# EAGLE design MAAV_Vehicle_13v1 (EAGLE 6.4)

## Sheet 1 of 8
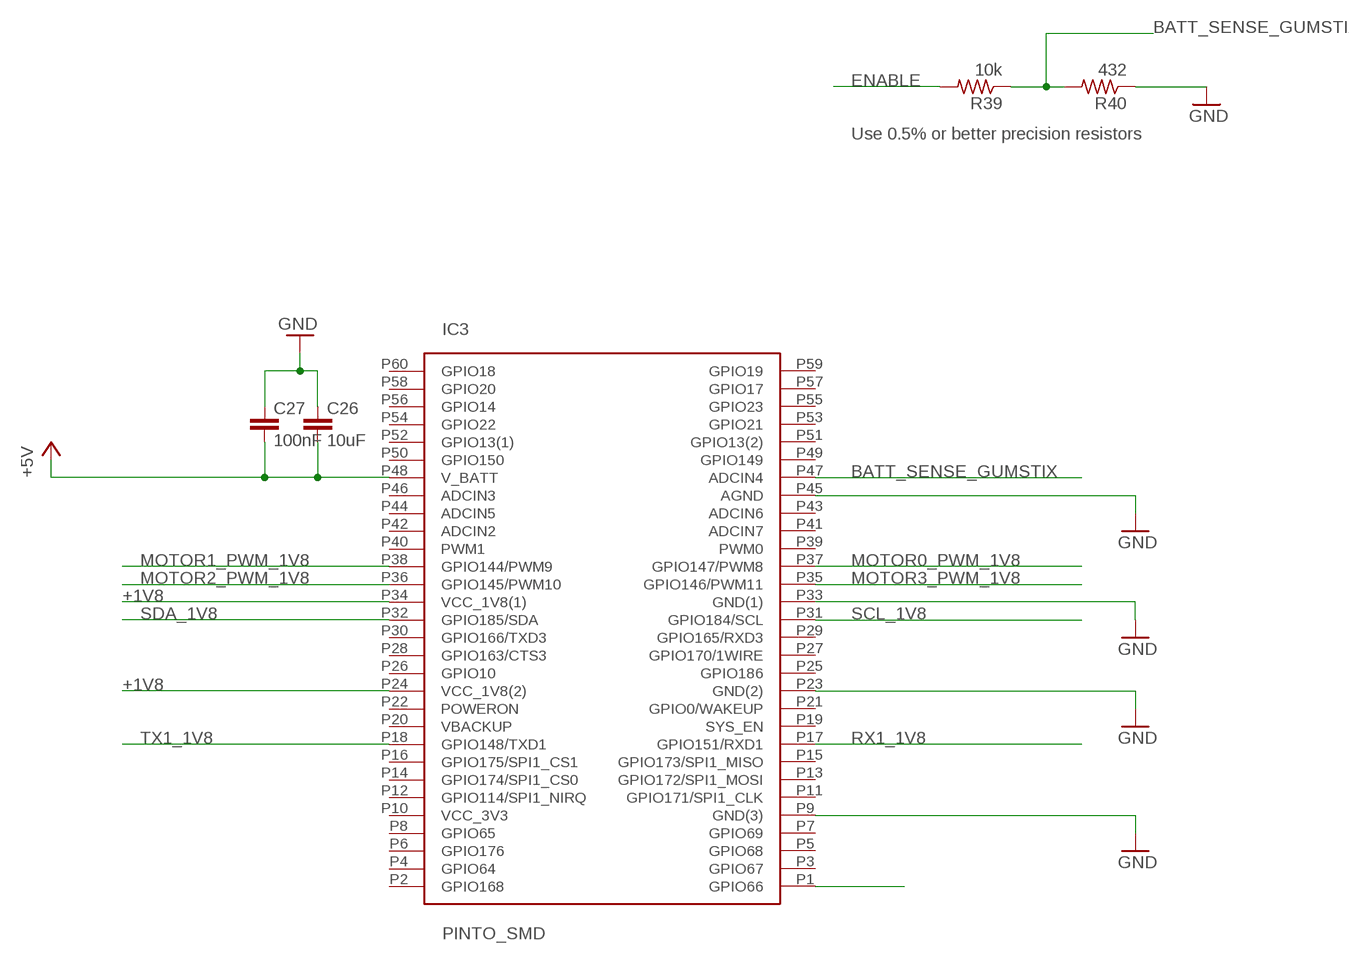
[diagram p0: schematic, sheet 1]

### Parts
C26  10uF  C-EUC1206  [C1206]
C27  100nF  C-EUC0603  [C0603]
IC3  PINTO_SMD  [PINTO_SMD]
R39  10k  R-USR0603  [R0603]
R40  432  R-USR0603  [R0603]

### Nets
+1V8: IC3.P24(VCC_1V8(2)) IC3.P34(VCC_1V8(1)) ; also sheet 3,7
+5V: C26.2 C27.2 IC3.P48(V_BATT) ; also sheet 2,3,4,7,8
BATT_SENSE_GUMSTIX: IC3.P47(ADCIN4) R39.1 R40.2
ENABLE: R39.2 ; also sheet 2,4
GND: C26.1 C27.1 IC3.P9(GND(3)) IC3.P23(GND(2)) IC3.P33(GND(1)) IC3.P45(AGND) R40.1 ; also sheet 2,4,5,6,7,8
MOTOR0_PWM_1V8: IC3.P37(GPIO147/PWM8) ; also sheet 3
MOTOR1_PWM_1V8: IC3.P38(GPIO144/PWM9) ; also sheet 3
MOTOR2_PWM_1V8: IC3.P36(GPIO145/PWM10) ; also sheet 3
MOTOR3_PWM_1V8: IC3.P35(GPIO146/PWM11) ; also sheet 3
N$44: IC3.P1(GPIO66)
RX1_1V8: IC3.P17(GPIO151/RXD1) ; also sheet 7
SCL_1V8: IC3.P31(GPIO184/SCL) ; also sheet 3
SDA_1V8: IC3.P32(GPIO185/SDA) ; also sheet 3
TX1_1V8: IC3.P18(GPIO148/TXD1) ; also sheet 7
Unconnected: IC3.P2(GPIO168) IC3.P3(GPIO67) IC3.P4(GPIO64) IC3.P5(GPIO68) IC3.P6(GPIO176) IC3.P7(GPIO69) IC3.P8(GPIO65) IC3.P10(VCC_3V3) IC3.P11(GPIO171/SPI1_CLK) IC3.P12(GPIO114/SPI1_NIRQ) IC3.P13(GPIO172/SPI1_MOSI) IC3.P14(GPIO174/SPI1_CS0) IC3.P15(GPIO173/SPI1_MISO) IC3.P16(GPIO175/SPI1_CS1) IC3.P19(SYS_EN) IC3.P20(VBACKUP) IC3.P21(GPIO0/WAKEUP) IC3.P22(POWERON) IC3.P25(GPIO186) IC3.P26(GPIO10) IC3.P27(GPIO170/1WIRE) IC3.P28(GPIO163/CTS3) IC3.P29(GPIO165/RXD3) IC3.P30(GPIO166/TXD3) IC3.P39(PWM0) IC3.P40(PWM1) IC3.P41(ADCIN7) IC3.P42(ADCIN2) IC3.P43(ADCIN6) IC3.P44(ADCIN5) IC3.P46(ADCIN3) IC3.P49(GPIO149) IC3.P50(GPIO150) IC3.P51(GPIO13(2)) IC3.P52(GPIO13(1)) IC3.P53(GPIO21) IC3.P54(GPIO22) IC3.P55(GPIO23) IC3.P56(GPIO14) IC3.P57(GPIO17) IC3.P58(GPIO20) IC3.P59(GPIO19) IC3.P60(GPIO18)

### Notes on the sheet
- Use 0.5% or better precision resistors

## Sheet 2 of 8
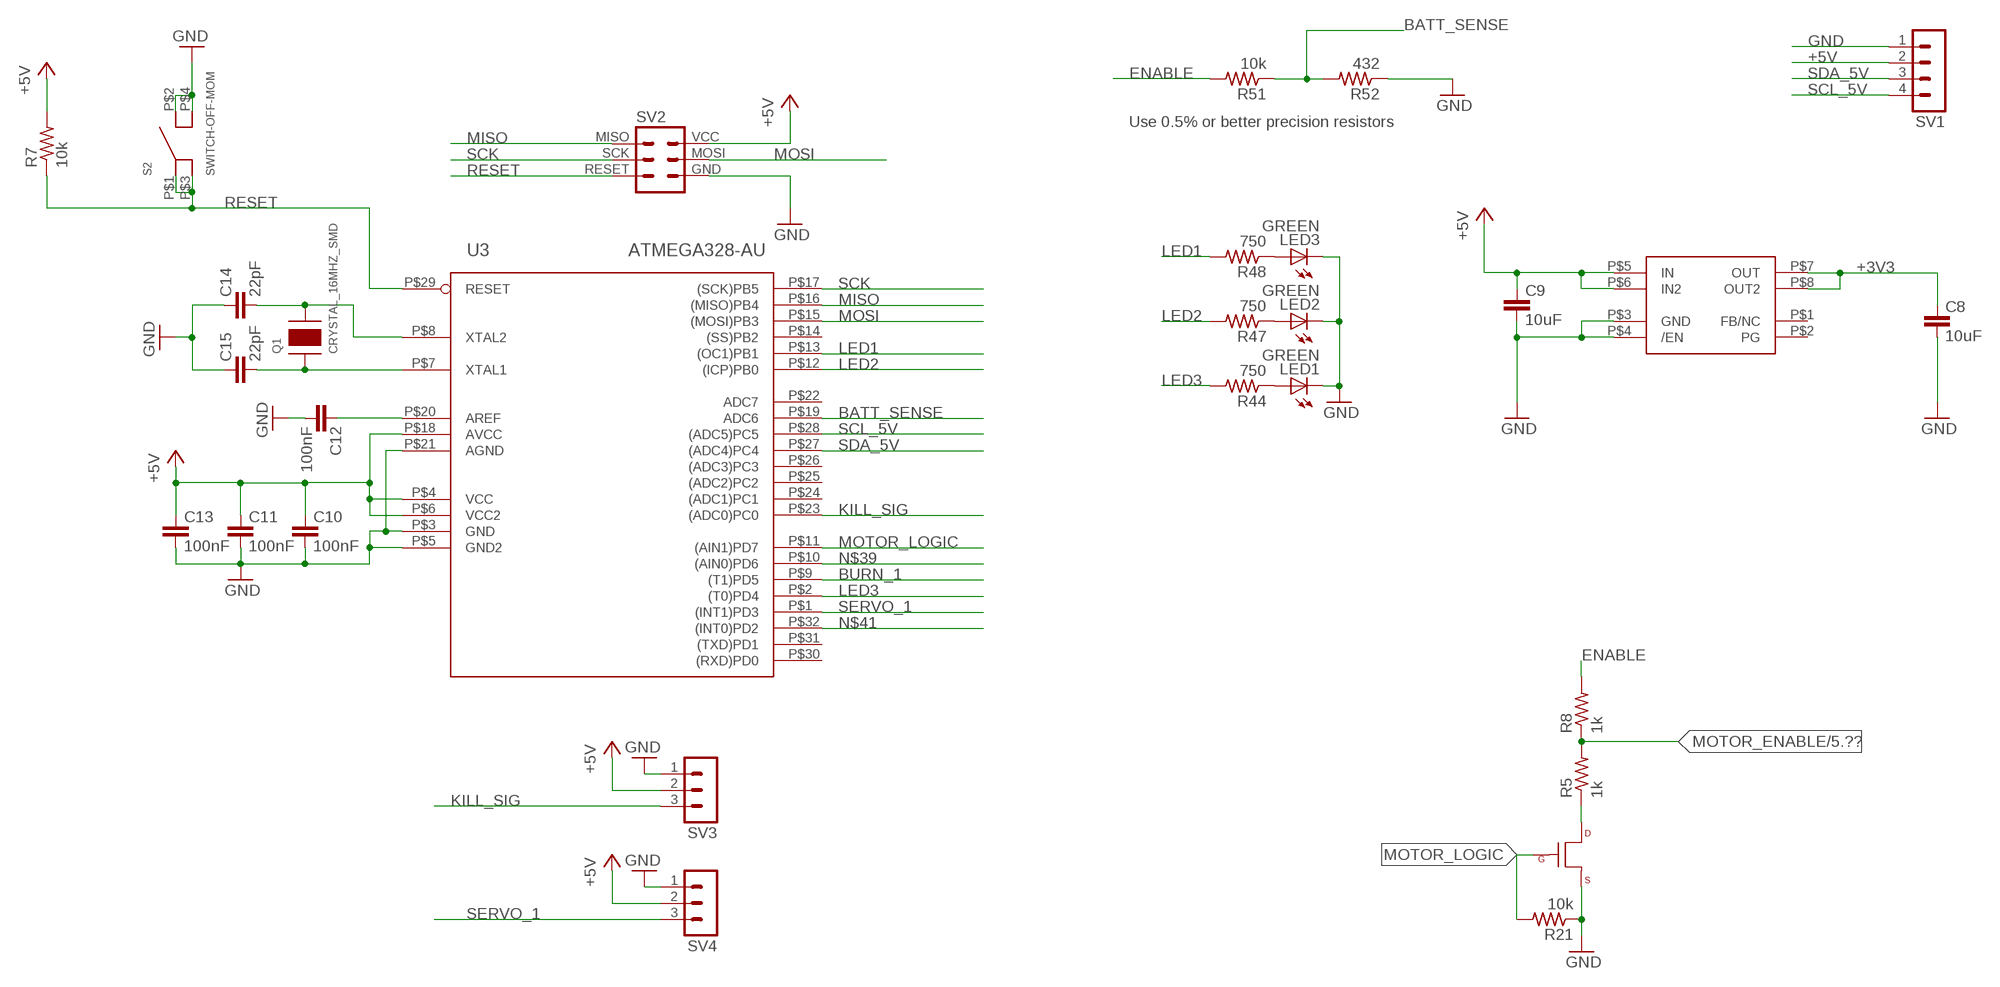
[diagram p1: schematic, sheet 2]

### Parts
C8  10uF  C-EUC1206  [C1206]
C9  10uF  C-EUC1206  [C1206]
C10  100nF  C-EUC0603  [C0603]
C11  100nF  C-EUC0603  [C0603]
C12  100nF  C-EUC0603  [C0603]
C13  100nF  C-EUC0603  [C0603]
C14  22pF  C-EUC0603  [C0603]
C15  22pF  C-EUC0603  [C0603]
LED1  GREEN  LEDCHIPLED_0603  [CHIPLED_0603]
LED2  GREEN  LEDCHIPLED_0603  [CHIPLED_0603]
LED3  GREEN  LEDCHIPLED_0603  [CHIPLED_0603]
Q1  CRYSTAL_16MHZ_SMD  [4-SMD_DFN]
R5  1k  R-USR0603  [R0603]
R7  10k  R-USR0603  [R0603]
R8  1k  R-USR0603  [R0603]
R21  10k  R-USR0603  [R0603]
R44  750  R-USR0805  [R0805]
R47  750  R-USR0805  [R0805]
R48  750  R-USR0805  [R0805]
R51  10k  R-USR0603  [R0603]
R52  432  R-USR0603  [R0603]
S2  SWITCH-OFF-MOM  [SWITCH-OFF-MOM]
SV1  MA04-1  [MA04-1]
SV2  AVRISP-63X2_SMD  [AVRISP-6-SMD]
SV3  MA03-1  [MA03-1]
SV4  MA03-1  [MA03-1]
T11  MOSFET-NCHANNELSMD  [SOT23-3]
U3  ATMEGA328-AU  [32-TQFP]
U4  REG_3V_8SOIC  [8-SOIC]

### Nets
+3V3: C8.1 U4.P$7(OUT) U4.P$8(OUT2)
+5V: C9.1 C10.1 C11.1 C13.1 R7.2 SV1.2 SV2.VCC SV3.2 SV4.2 U3.P$4(VCC) U3.P$6(VCC2) U3.P$18(AVCC) U4.P$5(IN) U4.P$6(IN2) ; also sheet 1,3,4,7,8
BATT_SENSE: R51.1 R52.2 U3.P$19(ADC6)
BURN_1: U3.P$9((T1)PD5) ; also sheet 8
ENABLE: R8.2 R51.2 ; also sheet 1,4
GND: C8.2 C9.2 C10.2 C11.2 C12.2 C13.2 C14.1 C15.1 LED1.C LED2.C LED3.C R21.1 R52.1 S2.P$2(P2) S2.P$4(P4) SV1.1 SV2.GND SV3.1 SV4.1 T11.2(S) U3.P$3(GND) U3.P$5(GND2) U3.P$21(AGND) U4.P$3(GND) U4.P$4(/EN) ; also sheet 1,4,5,6,7,8
KILL_SIG: SV3.3 U3.P$23((ADC0)PC0)
LED1: R48.2 U3.P$13((OC1)PB1)
LED2: R47.2 U3.P$12((ICP)PB0)
LED3: R44.2 U3.P$2((T0)PD4)
MISO: SV2.MISO U3.P$16((MISO)PB4)
MOSI: SV2.MOSI U3.P$15((MOSI)PB3)
MOTOR_ENABLE: R5.2 R8.1 ; also sheet 5
MOTOR_LOGIC: R21.2 T11.1(G) U3.P$11((AIN1)PD7)
N$2: LED1.A R44.1
N$3: C12.1 U3.P$20(AREF)
N$6: C14.2 Q1.X2 U3.P$8(XTAL2)
N$7: R5.1 T11.3(D)
N$8: C15.2 Q1.X1 U3.P$7(XTAL1)
N$33: LED2.A R47.1
N$34: LED3.A R48.1
N$39: U3.P$10((AIN0)PD6)
N$41: U3.P$32((INT0)PD2)
RESET: R7.1 S2.P$1(P1) S2.P$3(P3) SV2.RESET U3.P$29(RESET)
SCK: SV2.SCK U3.P$17((SCK)PB5)
SCL_5V: SV1.4 U3.P$28((ADC5)PC5) ; also sheet 3,5
SDA_5V: SV1.3 U3.P$27((ADC4)PC4) ; also sheet 3,5
SERVO_1: SV4.3 U3.P$1((INT1)PD3)
Unconnected: U3.P$14((SS)PB2) U3.P$22(ADC7) U3.P$24((ADC1)PC1) U3.P$25((ADC2)PC2) U3.P$26((ADC3)PC3) U3.P$30((RXD)PD0) U3.P$31((TXD)PD1) U4.P$1(FB/NC) U4.P$2(PG)

### Notes on the sheet
- Use 0.5% or better precision resistors

## Sheet 3 of 8
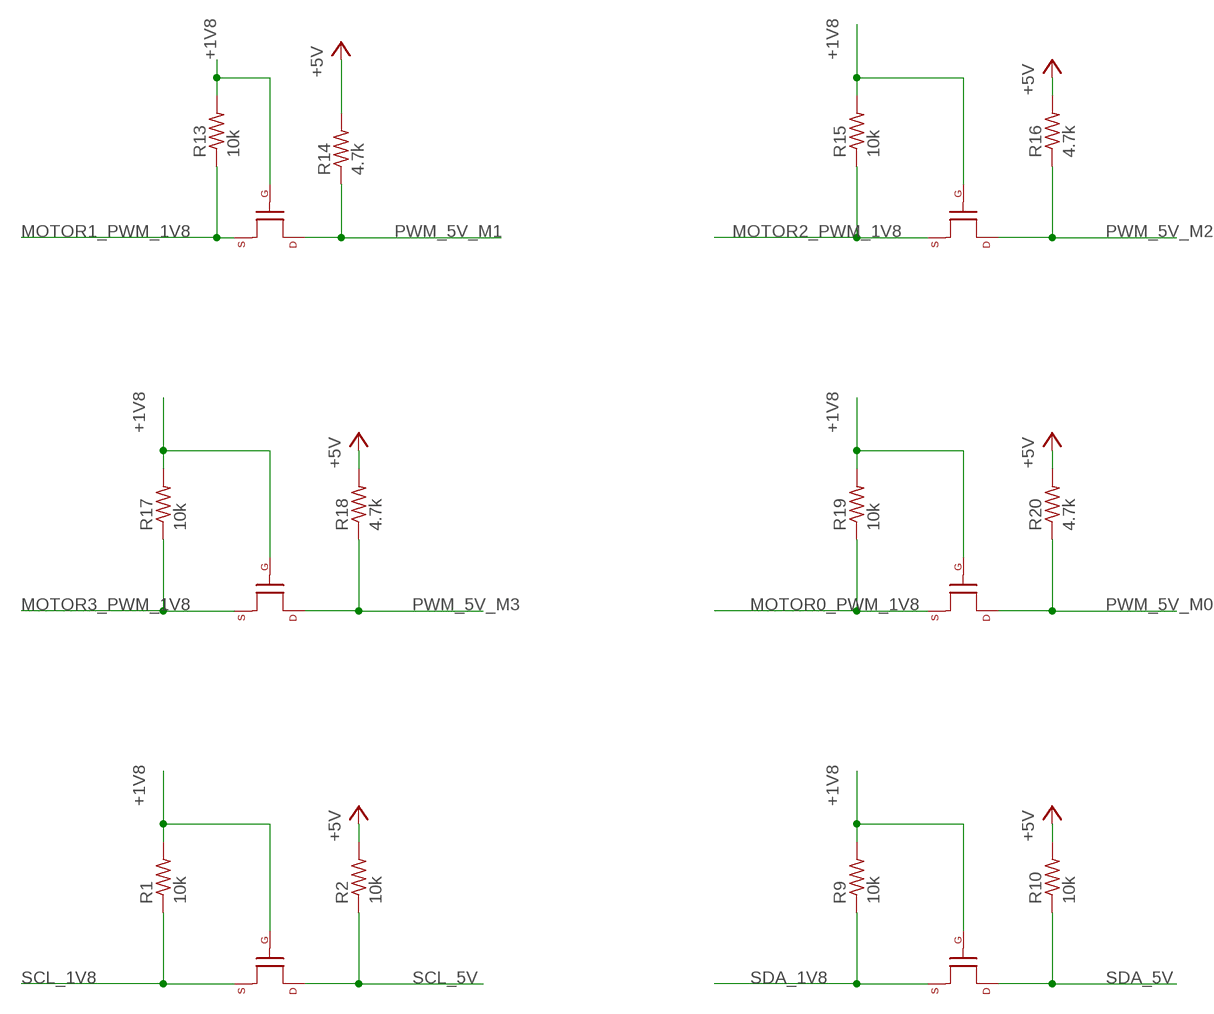
[diagram p2: schematic, sheet 3]

### Parts
R1  10k  R-USR0603  [R0603]
R2  10k  R-USR0603  [R0603]
R9  10k  R-USR0603  [R0603]
R10  10k  R-USR0603  [R0603]
R13  10k  R-USR0603  [R0603]
R14  4.7k  R-USR0603  [R0603]
R15  10k  R-USR0603  [R0603]
R16  4.7k  R-USR0603  [R0603]
R17  10k  R-USR0603  [R0603]
R18  4.7k  R-USR0603  [R0603]
R19  10k  R-USR0603  [R0603]
R20  4.7k  R-USR0603  [R0603]
T3  MOSFET-NCHANNELSMD  [SOT23-3]
T4  MOSFET-NCHANNELSMD  [SOT23-3]
T7  MOSFET-NCHANNELSMD  [SOT23-3]
T8  MOSFET-NCHANNELSMD  [SOT23-3]
T9  MOSFET-NCHANNELSMD  [SOT23-3]
T10  MOSFET-NCHANNELSMD  [SOT23-3]

### Nets
+1V8: R1.2 R9.2 R13.2 R15.2 R17.2 R19.2 T3.1(G) T4.1(G) T7.1(G) T8.1(G) T9.1(G) T10.1(G) ; also sheet 1,7
+5V: R2.2 R10.2 R14.2 R16.2 R18.2 R20.2 ; also sheet 1,2,4,7,8
MOTOR0_PWM_1V8: R19.1 T10.2(S) ; also sheet 1
MOTOR1_PWM_1V8: R13.1 T7.2(S) ; also sheet 1
MOTOR2_PWM_1V8: R15.1 T8.2(S) ; also sheet 1
MOTOR3_PWM_1V8: R17.1 T9.2(S) ; also sheet 1
PWM_5V_M0: R20.1 T10.3(D) ; also sheet 5
PWM_5V_M1: R14.1 T7.3(D) ; also sheet 5
PWM_5V_M2: R16.1 T8.3(D) ; also sheet 5
PWM_5V_M3: R18.1 T9.3(D) ; also sheet 5
SCL_1V8: R1.1 T3.2(S) ; also sheet 1
SCL_5V: R2.1 T3.3(D) ; also sheet 2,5
SDA_1V8: R9.1 T4.2(S) ; also sheet 1
SDA_5V: R10.1 T4.3(D) ; also sheet 2,5

## Sheet 4 of 8
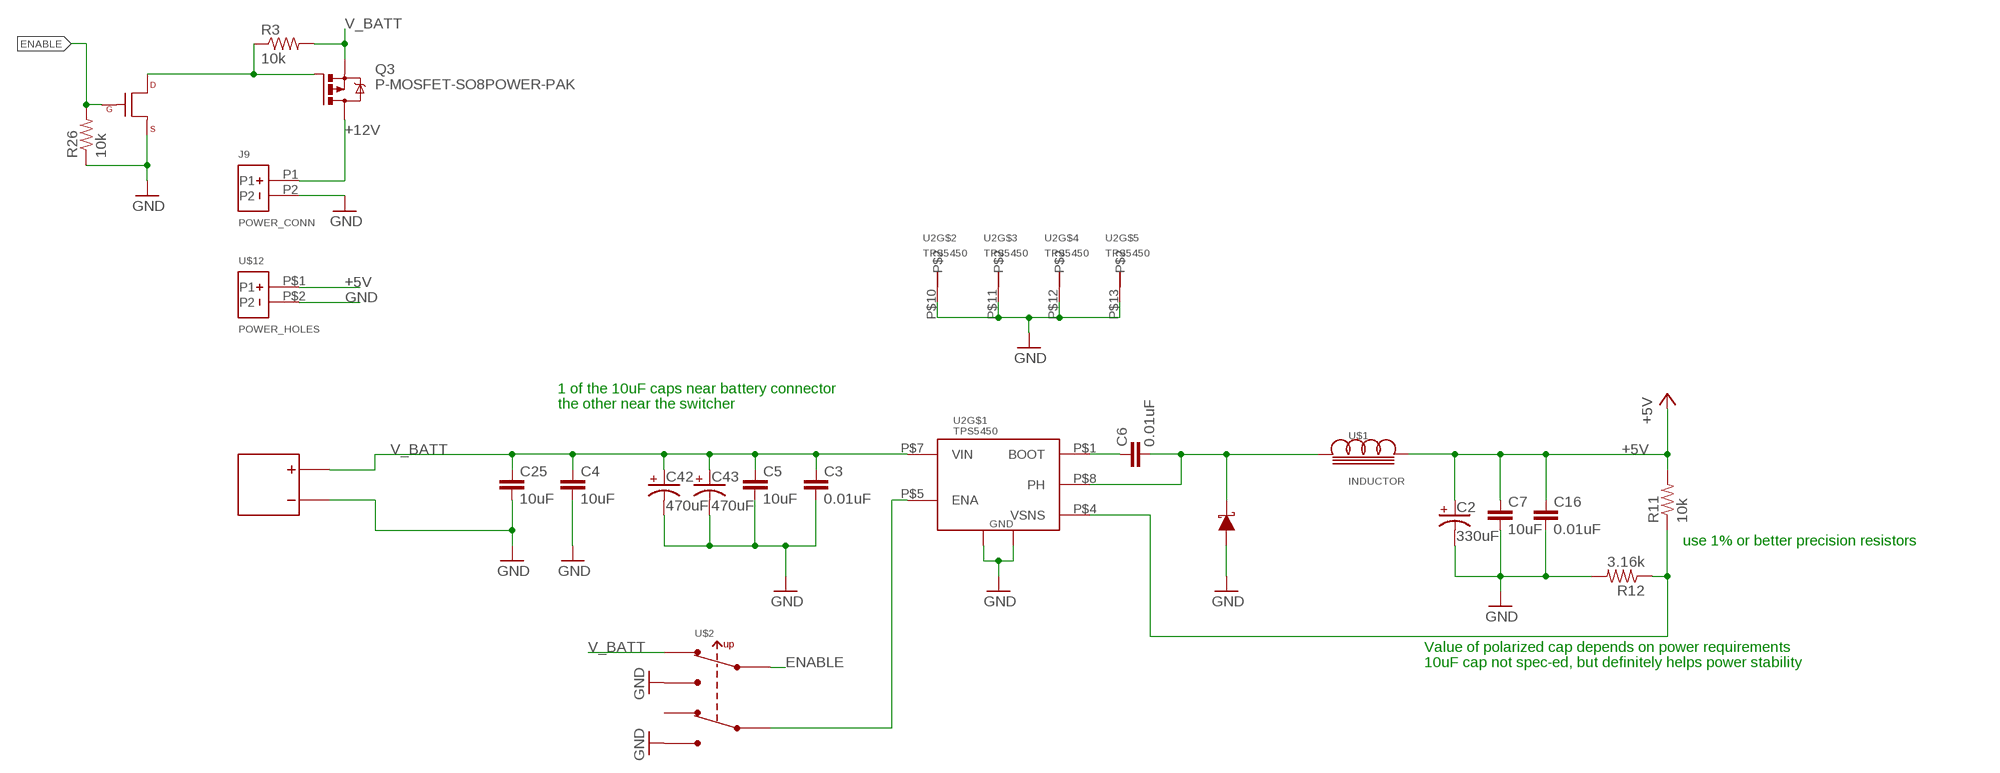
[diagram p3: schematic, sheet 4]

### Parts
C2  330uF  C-POL-TANT  [C_2917_POL]
C3  0.01uF  C-EUC0603  [C0603]
C4  10uF  C-EUC1206  [C1206]
C5  10uF  C-EUC1206  [C1206]
C6  0.01uF  C-EUC0603  [C0603]
C7  10uF  C-EUC1206  [C1206]
C16  0.01uF  C-EUC0603  [C0603]
C25  10uF  C-EUC1206  [C1206]
C42  470uF  C-POL-AL-8-22  [EH22-9]
C43  470uF  C-POL-AL-8-22  [EH22-9]
J9  POWER_CONN  [POWER_CONN]
Q2  MOSFET-NCHANNELSMD  [SOT23-3]
Q3  P-MOSFET-SO8POWER-PAK  [SO-8_POWER-PAK]
R3  10k  R-USR0603  [R0603]
R11  10k  R-USR0603  [R0603]
R12  3.16k  R-USR0603  [R0603]
R26  10k  R-USR0603  [R0603]
U2  TPS5450  [TPS5450]
U$1  INDUCTOR  [CDRH127]
U$2  SWITCH_DPDT  [SWITCH_VERT_DPDT]
U$9  DIODE-SCHOTTKYBIG  [DO-214AB,SMC]
U$12  POWER_HOLES  [POWER_HOLES]
U$13  BATTERY50A  [LIPO_POWER_50A]

### Nets
+5V: C2.A(ANODE) C7.1 C16.1 R11.2 U$1.P2 U$12.P$1(P1) ; also sheet 1,2,3,7,8
+12V: J9.P1 Q3.D1 Q3.D2(D1) Q3.D3(D1) Q3.D4(D1) Q3.D5(D1) ; also sheet 6
ENABLE: Q2.1(G) R26.2 U$2.P$5 ; also sheet 1,2
GND: C2.C(CATHODE) C3.2 C4.2 C5.2 C7.2 C16.2 C25.2 C42.G(CATHODE) C43.G(CATHODE) J9.P2 Q2.2(S) R12.2 R26.1 U2.P$6(GND) U2.P$9(PGND) U2.P$10 U2.P$11 U2.P$12 U2.P$13 U$2.P$1 U$2.P$4 U$9.A U$12.P$2(P2) U$13.GND ; also sheet 1,2,5,6,7,8
N$4: R11.1 R12.1 U2.P$4(VSNS)
N$9: C6.1 U2.P$1(BOOT)
N$11: U2.P$5(ENA) U$2.P$2
N$27: Q2.3(D) Q3.G R3.1
N$28: C6.2 U2.P$8(PH) U$1.P1 U$9.C
V_BATT: C3.1 C4.1 C5.1 C25.1 C42.P(ANODE) C43.P(ANODE) Q3.S1 Q3.S2(S1) Q3.S3(S1) R3.2 U2.P$7(VIN) U$2.P$6 U$13.BATT ; also sheet 5,6,8
Unconnected: U$2.P$3

### Notes on the sheet
- 1 of the 10uF caps near battery connector
- the other near the switcher
- use 1% or better precision resistors
- Value of polarized cap depends on power requirements
- 10uF cap not spec-ed, but definitely helps power stability

## Sheet 5 of 8
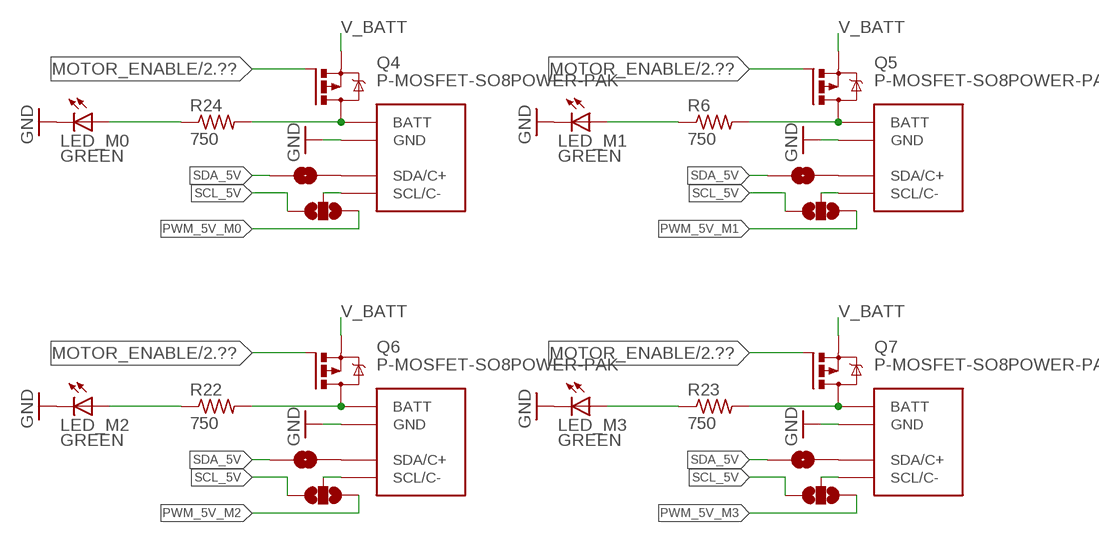
[diagram p4: schematic, sheet 5]

### Parts
LED_M0  GREEN  LEDCHIPLED_0805  [CHIPLED_0805]
LED_M1  GREEN  LEDCHIPLED_0805  [CHIPLED_0805]
LED_M2  GREEN  LEDCHIPLED_0805  [CHIPLED_0805]
LED_M3  GREEN  LEDCHIPLED_0805  [CHIPLED_0805]
Q4  P-MOSFET-SO8POWER-PAK  [SO-8_POWER-PAK]
Q5  P-MOSFET-SO8POWER-PAK  [SO-8_POWER-PAK]
Q6  P-MOSFET-SO8POWER-PAK  [SO-8_POWER-PAK]
Q7  P-MOSFET-SO8POWER-PAK  [SO-8_POWER-PAK]
R6  750  R-USR0805  [R0805]
R22  750  R-USR0805  [R0805]
R23  750  R-USR0805  [R0805]
R24  750  R-USR0805  [R0805]
SJ1  SOLDERJUMPERNO  [SJ_2S-NO]
SJ2  SOLDERJUMPERNO  [SJ_2S-NO]
SJ3  SOLDERJUMPER_2WAYS  [SJ_3]
SJ4  SOLDERJUMPER_2WAYS  [SJ_3]
SJ5  SOLDERJUMPERNO  [SJ_2S-NO]
SJ6  SOLDERJUMPER_2WAYS  [SJ_3]
SJ7  SOLDERJUMPERNO  [SJ_2S-NO]
SJ8  SOLDERJUMPER_2WAYS  [SJ_3]
U$3  ESC_CONN  [ESC_CONN]
U$4  ESC_CONN  [ESC_CONN]
U$5  ESC_CONN  [ESC_CONN]
U$6  ESC_CONN  [ESC_CONN]

### Nets
GND: LED_M0.C LED_M1.C LED_M2.C LED_M3.C U$3.GND U$4.GND U$5.GND U$6.GND ; also sheet 1,2,4,6,7,8
MOTOR_ENABLE: Q4.G Q5.G Q6.G Q7.G ; also sheet 2
N$5: Q4.D1 Q4.D2(D1) Q4.D3(D1) Q4.D4(D1) Q4.D5(D1) R24.2 U$3.BATT
N$10: SJ2.2 U$3.SDA/C+
N$12: SJ3.2 U$3.SCL/C-
N$13: LED_M0.A R24.1
N$14: Q5.D1 Q5.D2(D1) Q5.D3(D1) Q5.D4(D1) Q5.D5(D1) R6.2 U$4.BATT
N$15: LED_M1.A R6.1
N$16: SJ1.2 U$4.SDA/C+
N$17: SJ4.2 U$4.SCL/C-
N$18: Q6.D1 Q6.D2(D1) Q6.D3(D1) Q6.D4(D1) Q6.D5(D1) R22.2 U$5.BATT
N$19: LED_M2.A R22.1
N$20: SJ5.2 U$5.SDA/C+
N$21: SJ6.2 U$5.SCL/C-
N$22: Q7.D1 Q7.D2(D1) Q7.D3(D1) Q7.D4(D1) Q7.D5(D1) R23.2 U$6.BATT
N$23: LED_M3.A R23.1
N$25: SJ7.2 U$6.SDA/C+
N$26: SJ8.2 U$6.SCL/C-
PWM_5V_M0: SJ3.1 ; also sheet 3
PWM_5V_M1: SJ4.1 ; also sheet 3
PWM_5V_M2: SJ6.1 ; also sheet 3
PWM_5V_M3: SJ8.1 ; also sheet 3
SCL_5V: SJ3.3 SJ4.3 SJ6.3 SJ8.3 ; also sheet 2,3
SDA_5V: SJ1.1 SJ2.1 SJ5.1 SJ7.1 ; also sheet 2,3
V_BATT: Q4.S1 Q4.S2(S1) Q4.S3(S1) Q5.S1 Q5.S2(S1) Q5.S3(S1) Q6.S1 Q6.S2(S1) Q6.S3(S1) Q7.S1 Q7.S2(S1) Q7.S3(S1) ; also sheet 4,6,8

## Sheet 6 of 8
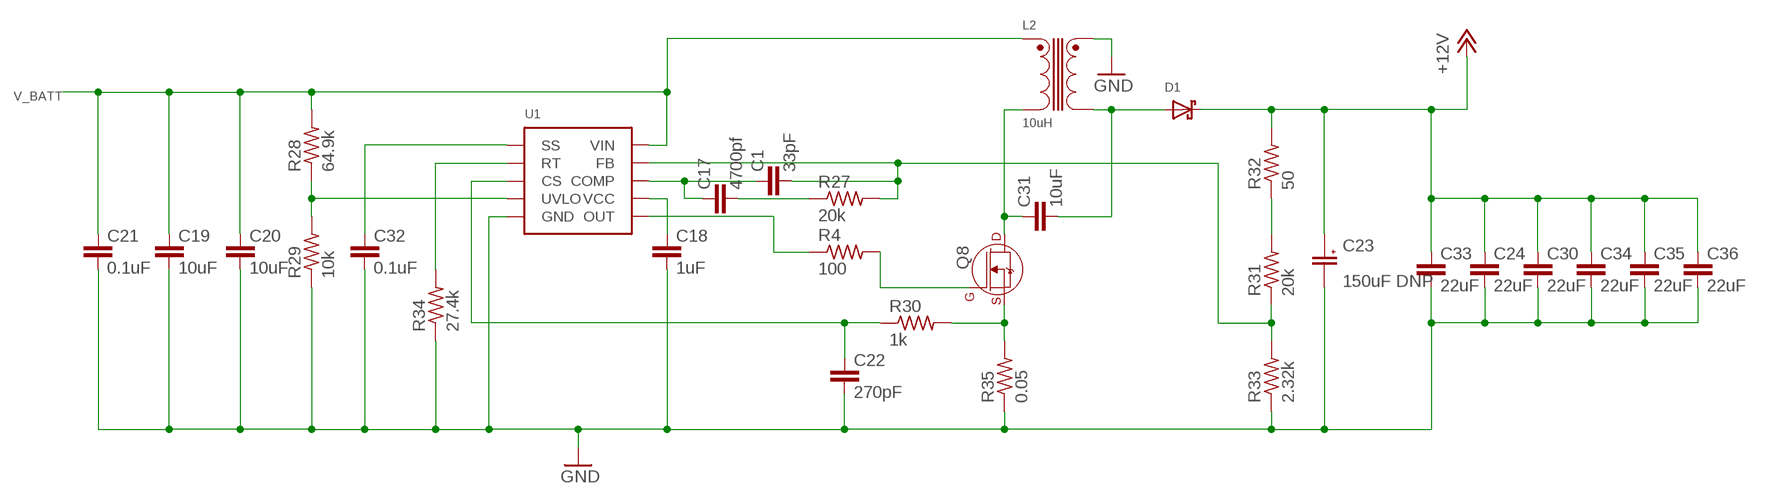
[diagram p5: schematic, sheet 6]

### Parts
C1  33pF  C-EUC0402  [C0402]
C17  4700pf  C-EUC0402  [C0402]
C18  1uF  C-EUC0603  [C0603]
C19  10uF  C-EUC1206  [C1206]
C20  10uF  C-EUC1206  [C1206]
C21  0.1uF  C-EUC0603  [C0603]
C22  270pF  C-EUC0402  [C0402]
C23  150uF DNP  T530X157M016ATE015  [C2917]
C24  22uF  C-EUC1206  [C1206]
C30  22uF  C-EUC1206  [C1206]
C31  10uF  C-EUC1206  [C1206]
C32  0.1uF  C-EUC0402  [C0402]
C33  22uF  C-EUC1206  [C1206]
C34  22uF  C-EUC1206  [C1206]
C35  22uF  C-EUC1206  [C1206]
C36  22uF  C-EUC1206  [C1206]
D1  PDS760  [PDS760]
L2  10uH  DRQ125  [DRQ125]
Q8  STL60N3LLH5  [POWERFLAT-8]
R4  100  R-USR0402  [R0402]
R27  20k  R-USR0402  [R0402]
R28  64.9k  R-USR0402  [R0402]
R29  10k  R-USR0402  [R0402]
R30  1k  R-USR0402  [R0402]
R31  20k  R-USR0402  [R0402]
R32  50  R-USR0402  [R0402]
R33  2.32k  R-USR0402  [R0402]
R34  27.4k  R-USR0402  [R0402]
R35  0.05  R-US_R2512  [R2512]
U1  LM5022  [MSOP-10]

### Nets
+12V: C23.+ C24.1 C30.1 C33.1 C34.1 C35.1 C36.1 D1.C(CATHODE) R32.2 ; also sheet 4
COMP: C1.1 C17.1 U1.P$3(COMP)
CS: C22.1 R30.1 U1.P$8(CS)
FB2: C1.2 R27.2 R31.1 R33.2 U1.P$2(FB)
GND: C18.2 C19.2 C20.2 C21.2 C22.2 C23.- C24.2 C30.2 C32.2 C33.2 C34.2 C35.2 C36.2 L2.2 R29.1 R33.1 R34.1 R35.1 U1.P$6(GND) ; also sheet 1,2,4,5,7,8
N$24: C17.2 R27.1
N$29: Q8.P$4(G) R4.2
N$30: C31.2 D1.A1(ANODE) D1.A2(ANODE) L2.4
N$31: R31.2 R32.1
OUT: R4.1 U1.P$5(OUT)
Q3_D: C31.1 L2.3 Q8.P$5(D)
Q3_S: Q8.P$1(S) Q8.P$2(S) Q8.P$3(S) R30.2 R35.2
RT: R34.2 U1.P$9(RT)
SS2: C32.1 U1.P$10(SS)
UVLO: R28.1 R29.2 U1.P$7(UVLO)
V_BATT: C19.1 C20.1 C21.1 L2.1 R28.2 U1.P$1(VIN) ; also sheet 4,5,8
VCC2: C18.1 U1.P$4(VCC)

## Sheet 7 of 8
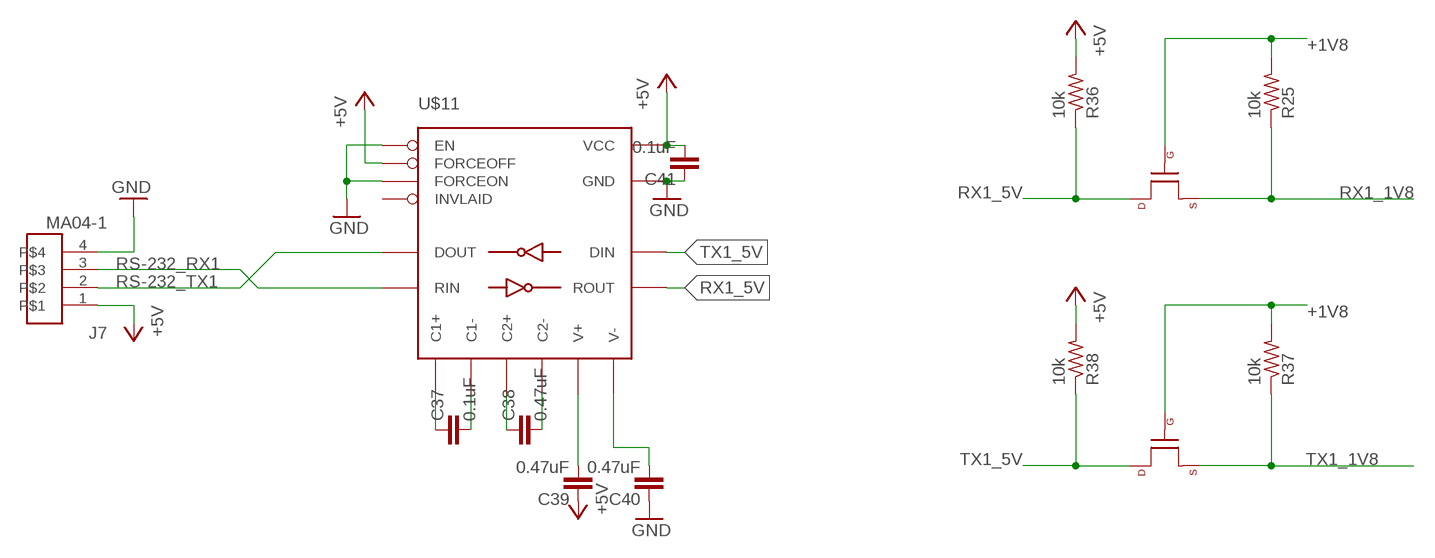
[diagram p6: schematic, sheet 7]

### Parts
C37  0.1uF  C-EUC0603  [C0603]
C38  0.47uF  C-EUC0805  [C0805]
C39  0.47uF  C-EUC0805  [C0805]
C40  0.47uF  C-EUC0805  [C0805]
C41  0.1uF  C-EUC0603  [C0603]
J7  MA04-1  [MA-04-SMD]
R25  10k  R-USR0603  [R0603]
R36  10k  R-USR0603  [R0603]
R37  10k  R-USR0603  [R0603]
R38  10k  R-USR0603  [R0603]
T1  MOSFET-NCHANNELSMD  [SOT23-3]
T2  MOSFET-NCHANNELSMD  [SOT23-3]
U$11  MAX3221-RS232  [16-TSSOP]

### Nets
+1V8: R25.2 R37.2 T1.1(G) T2.1(G) ; also sheet 1,3
+5V: C39.1 C41.2 J7.1 R36.2 R38.2 U$11.P$15(VCC) U$11.P$16(FORCEOFF) ; also sheet 1,2,3,4,8
GND: C40.1 C41.1 J7.4 U$11.P$1(EN) U$11.P$12(FORCEON) U$11.P$14(GND) ; also sheet 1,2,4,5,6,8
N$1: C37.1 U$11.P$2(C1+)
N$32: C37.2 U$11.P$4(C1-)
N$35: C38.1 U$11.P$5(C2+)
N$36: C38.2 U$11.P$6(C2-)
N$37: C39.2 U$11.P$3(V+)
N$38: C40.2 U$11.P$7(V-)
RS-232_RX1: J7.3 U$11.P$8(RIN)
RS-232_TX1: J7.2 U$11.P$13(DOUT)
RX1_1V8: R25.1 T1.2(S) ; also sheet 1
RX1_5V: R36.1 T1.3(D) U$11.P$9(ROUT)
TX1_1V8: R37.1 T2.2(S) ; also sheet 1
TX1_5V: R38.1 T2.3(D) U$11.P$11(DIN)
Unconnected: U$11.P$10(INVLAID)

## Sheet 8 of 8
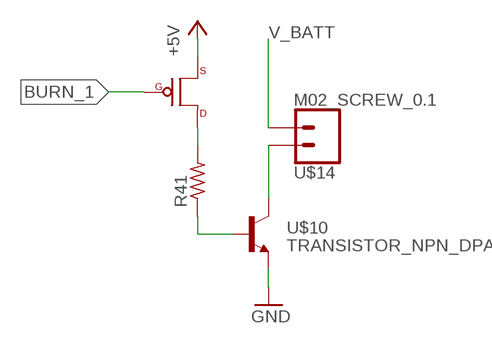
[diagram p7: schematic, sheet 8]

### Parts
R41  R-USR1206  [R1206]
U$10  TRANSISTOR_NPN_DPAK  [DPAK]
U$14  M02_SCREW_0.1  [SCREW_TERM_2POS]
U$15  MOSFET-PCHANNEL_SOT23-3  [SOT23-3]

### Nets
+5V: U$15.3(D) ; also sheet 1,2,3,4,7
BURN_1: U$15.1(G) ; also sheet 2
GND: U$10.3(E) ; also sheet 1,2,4,5,6,7
N$40: U$10.TAB(C) U$14.P$2
N$42: R41.2 U$15.2(S)
N$43: R41.1 U$10.1(B)
V_BATT: U$14.P$1 ; also sheet 4,5,6

## Library data of the parts
C1 C17 C22 C32 = Jon_LIB:C-EU: CAPACITOR, European symbol; DIGIKEY#: box
C2 = Jon_LIB:C-POL-; DIGIKEY#: 478-1811-1-ND
C3 C6 C16 = Jon_LIB:C-EU: CAPACITOR, European symbol; DIGIKEY#: 490-1512-1-ND
C4 C5 C7-C9 C19 C20 C25 C26 C31 = Jon_LIB:C-EU: CAPACITOR, European symbol; DIGIKEY#: 587-2399-1-ND
C10-C13 C21 C27 = Jon_LIB:C-EU: CAPACITOR, European symbol; DIGIKEY#: 1276-1000-1-ND
C14 C15 = Jon_LIB:C-EU: CAPACITOR, European symbol; DIGIKEY#: 478-6200-1-ND
C18 = Jon_LIB:C-EU: CAPACITOR, European symbol; DIGIKEY#: 587-2984-1-ND
C23 = maav_personal:T530X157M016ATE015; PARTNUM: 399-4663-1-ND
C24 C30 C33-C36 = Jon_LIB:C-EU: CAPACITOR, European symbol; DIGIKEY#: 587-3246-1-ND
C37 C41 = Jon_LIB:C-EU: CAPACITOR, European symbol; DIGIKEY#: 490-1524-1-ND
C38-C40 = Jon_LIB:C-EU: CAPACITOR, European symbol; DIGIKEY#: 1276-2966-1-ND
C42 C43 = Jon_LIB:C-POL-; DIGIEKY#: P14440-ND
D1 = maav_personal:PDS760; DIGIKEY#: PDS760DICT-ND
IC3 = Jon_LIB:PINTO_SMD; DIGIKEY#: S5641-ND (6)
J7 = Jon_LIB:MA04-1; DIGIKEY#: 455-1751-1-ND
J9 = MAAV:POWER_CONN; DIGIKEY: A30614-ND
L2 = maav_personal:DRQ125; PARTNUM: 513-1289-1-ND
LED1-LED3 = Jon_LIB:LED: LED OSRAM: - CHIPLED LG R971, LG N971, LY N971, LG Q971, LY Q971, LO R971, LY R971 LH N974, LH R974 LS Q976, LO Q976, LY Q976 LO Q996 - Hyper CHIPLED LW Q18S LB Q993, LB Q99A, LB R99A - SideLED LS A670, LO A670, LY A670, LG A670, LP A670 LB A673, LV A673, LT A673, LW A673 LH A674 LY A675 LS A676, LA A676, LO A676, LY A676, LW A676 LS A679, LY A679, LG A679 - Hyper Micro SIDELED® LS Y876, LA Y876, LO Y876, LY Y876 LT Y87S - SmartLED LW L88C, LW L88S LB L89C, LB L89S, LG L890 LS L89K, LO L89K, LY L89K LS L896, LA L896, LO L896, LY L896 - TOPLED LS T670, LO T670, LY T670, LG T670, LP T670 LSG T670, LSP T670, LSY T670, LOP T670, LYG T670 LG T671, LOG T671, LSG T671 LB T673, LV T673, LT T673, LW T673 LH T674 LS T676, LA T676, LO T676, LY T676, LB T676, LH T676, LSB T676, LW T676 LB T67C, LV T67C, LT T67C, LS T67K, LO T67K, LY T67K, LW E67C LS E67B, LA E67B, LO E67B, LY E67B, LB E67C, LV E67C, LT E67C LW T67C LS T679, LY T679, LG T679 LS T770, LO T770, LY T770, LG T770, LP T770 LB T773, LV T773, LT T773, LW T773 LH T774 LS E675, LA E675, LY E675, LS T675 LS T776, LA T776, LO T776, LY T776, LB T776 LHGB T686 LT T68C, LB T68C - Hyper Mini TOPLED® LB M676 - Mini TOPLED Santana® LG M470 LS M47K, LO M47K, LY M47K Source: http://www.osram.convergy.de LUXEON: - LUMILED® LXK2-PW12-R00, LXK2-PW12-S00, LXK2-PW14-U00, LXK2-PW14-V00 LXK2-PM12-R00, LXK2-PM12-S00, LXK2-PM14-U00 LXK2-PE12-Q00, LXK2-PE12-R00, LXK2-PE12-S00, LXK2-PE14-T00, LXK2-PE14-U00 LXK2-PB12-K00, LXK2-PB12-L00, LXK2-PB12-M00, LXK2-PB14-N00, LXK2-PB14-P00, LXK2-PB14-Q00 LXK2-PR12-L00, LXK2-PR12-M00, LXK2-PR14-Q00, LXK2-PR14-R00 LXK2-PD12-Q00, LXK2-PD12-R00, LXK2-PD12-S00 LXK2-PH12-R00, LXK2-PH12-S00 LXK2-PL12-P00, LXK2-PL12-Q00, LXK2-PL12-R00 Source: www.luxeon.com KINGBRIGHT: KA-3528ASYC Source: www.kingbright.com; DIGIKEY#: 1080-1405-1-ND
LED_M0 LED_M1-LED_M3 = Jon_LIB:LED: LED OSRAM: - CHIPLED LG R971, LG N971, LY N971, LG Q971, LY Q971, LO R971, LY R971 LH N974, LH R974 LS Q976, LO Q976, LY Q976 LO Q996 - Hyper CHIPLED LW Q18S LB Q993, LB Q99A, LB R99A - SideLED LS A670, LO A670, LY A670, LG A670, LP A670 LB A673, LV A673, LT A673, LW A673 LH A674 LY A675 LS A676, LA A676, LO A676, LY A676, LW A676 LS A679, LY A679, LG A679 - Hyper Micro SIDELED® LS Y876, LA Y876, LO Y876, LY Y876 LT Y87S - SmartLED LW L88C, LW L88S LB L89C, LB L89S, LG L890 LS L89K, LO L89K, LY L89K LS L896, LA L896, LO L896, LY L896 - TOPLED LS T670, LO T670, LY T670, LG T670, LP T670 LSG T670, LSP T670, LSY T670, LOP T670, LYG T670 LG T671, LOG T671, LSG T671 LB T673, LV T673, LT T673, LW T673 LH T674 LS T676, LA T676, LO T676, LY T676, LB T676, LH T676, LSB T676, LW T676 LB T67C, LV T67C, LT T67C, LS T67K, LO T67K, LY T67K, LW E67C LS E67B, LA E67B, LO E67B, LY E67B, LB E67C, LV E67C, LT E67C LW T67C LS T679, LY T679, LG T679 LS T770, LO T770, LY T770, LG T770, LP T770 LB T773, LV T773, LT T773, LW T773 LH T774 LS E675, LA E675, LY E675, LS T675 LS T776, LA T776, LO T776, LY T776, LB T776 LHGB T686 LT T68C, LB T68C - Hyper Mini TOPLED® LB M676 - Mini TOPLED Santana® LG M470 LS M47K, LO M47K, LY M47K Source: http://www.osram.convergy.de LUXEON: - LUMILED® LXK2-PW12-R00, LXK2-PW12-S00, LXK2-PW14-U00, LXK2-PW14-V00 LXK2-PM12-R00, LXK2-PM12-S00, LXK2-PM14-U00 LXK2-PE12-Q00, LXK2-PE12-R00, LXK2-PE12-S00, LXK2-PE14-T00, LXK2-PE14-U00 LXK2-PB12-K00, LXK2-PB12-L00, LXK2-PB12-M00, LXK2-PB14-N00, LXK2-PB14-P00, LXK2-PB14-Q00 LXK2-PR12-L00, LXK2-PR12-M00, LXK2-PR14-Q00, LXK2-PR14-R00 LXK2-PD12-Q00, LXK2-PD12-R00, LXK2-PD12-S00 LXK2-PH12-R00, LXK2-PH12-S00 LXK2-PL12-P00, LXK2-PL12-Q00, LXK2-PL12-R00 Source: www.luxeon.com KINGBRIGHT: KA-3528ASYC Source: www.kingbright.com; DIGIKEY#: 350-2044-1-ND
Q1 = Jon_LIB:CRYSTAL_16MHZ; DIGIKEY#: XC1137CT-ND
Q2 = Jon_LIB:MOSFET-NCHANNEL; DIGIKEY#: BSS84CT-ND
Q3-Q7 = Jon_LIB:P-MOSFET-SO8: P-Channel MOSFET Example: FDS4435A; P-Channel Logic Level PowerTrench® MOSFET FDS4465; P-Channel 1.8V Specified PowerTrench® MOSFET Source: www.fairchildsemi.com; DIGIKEY#: SI7135DP-T1-GE3CT-ND
Q8 = maav_personal:STL60N3LLH5; PARTNUM: 497-11094-1-ND
R1-R3 R7 R9 R10 R13 R15 R17 R19 R21 R25 R26 R36-R38 = Jon_LIB:R-US: RESISTOR, American symbol; DIGIKEY#: P10.0KHCT-ND
R4 R27 R29-R32 R34 = Jon_LIB:R-US: RESISTOR, American symbol; DIGIKEY#: box
R5 R8 = Jon_LIB:R-US: RESISTOR, American symbol; DIGIKEY#: P1.00KHCT-ND
R6 R22-R24 R44 R47 R48 = Jon_LIB:R-US: RESISTOR, American symbol; DIGIKEY#: P750CCT-ND
R11 R39 R51 = Jon_LIB:R-US: RESISTOR, American symbol; DIGIKEY#: P10KDBCT-ND
R12 = Jon_LIB:R-US: RESISTOR, American symbol; DIGIKEY#: 311-3.16KDCT-ND
R14 R16 R18 R20 = Jon_LIB:R-US: RESISTOR, American symbol; DIGIKEY#: P4.70KHCT-ND
R28 = Jon_LIB:R-US: RESISTOR, American symbol; DIGIKEY#: P64.9KDCCT-ND
R33 = Jon_LIB:R-US: RESISTOR, American symbol; DIGIKEY#: P2.32KDCCT-ND
R35 = rcl:R-US_: RESISTOR, American symbol; DIGIKEY#: MCS3264R050FERCT-ND
R40 R52 = Jon_LIB:R-US: RESISTOR, American symbol; DIGIKEY#: P432DBCT-ND
R41 = Jon_LIB:R-US: RESISTOR, American symbol; DIGIKEY#: P100FCT-ND, P68.1FCT-ND, P200FCT-ND
S2 = p498:SWITCH-OFF-MOM; DIGIKEY: P11084SCT-ND; DIGIKEY#: P11084SCT-ND
SJ1 SJ2 SJ5 SJ7 = Jon_LIB:SOLDERJUMPER: Solder Jumper Standard SMD solder jumper. Used to automate production. Two varients : Normally Open and Normally Closed are the same, but have different paste layers. NC will have a large amount of paste and should jumper during reflow.
SJ3 SJ4 SJ6 SJ8 = Jon_LIB:SOLDERJUMPER_2WAY: Solder Jumper 2 way solder jumper
SV1 = con-lstb:MA04-1: PIN HEADER; OC_FARNELL: unknown; OC_NEWARK: unknown
SV2 = Jon_LIB:AVRISP-6: PIN HEADER
SV3 SV4 = Jon_LIB:MA03-1: PIN HEADER; DIGIKEY#: 3M9477-ND; OC_FARNELL: unknown; OC_NEWARK: unknown
T1-T4 T7-T11 = Jon_LIB:MOSFET-NCHANNEL; DIGIKEY#: BSS138KCT-ND
U1 = maav_personal:LM5022; PARTNUM: LM5022MM/NOPBCT-ND
U2 = MAAV:TPS5450; DIGIKEY: 296-23750-1-ND; DIGIKEY#: 296-23750-1-ND
U3 = MAAV:ATMEGA328-AU; DIGIKEY: ATMEGA328-AU-ND; DIGIKEY#: ATMEGA328-AU-ND
U4 = MAAV:REG_3V_8SOIC; DIGIKEY: 296-2719-5-ND; DIGIKEY#: 296-2719-5-ND
U$1 = Jon_LIB:INDUCTOR; DIGIEKY#: 308-1333-1-ND; DIGIKEY: 308-1333-1-ND
U$2 = Jon_LIB:SWITCH_DPDT; DIGIKEY#: AS22AV-ND
U$3-U$6 = Jon_LIB:ESC_CONN
U$9 = Jon_LIB:DIODE-SCHOTTKY; DIGIKEY#: B540C-FDICT-ND
U$10 = Jon_LIB:TRANSISTOR_NPN; DIGIKEY#: 497-12849-1-ND
U$11 = Jon_LIB:MAX3221-RS232; DIGIKEY#: 296-19825-1-ND
U$12 = MAAV:POWER_HOLES
U$13 = Jon_LIB:BATTERY
U$14 = Jon_LIB:M02; DIGIKEY#: A98333-ND
U$15 = Jon_LIB:MOSFET-PCHANNEL; DIGIKEY#: BSS84CT-ND

## Board
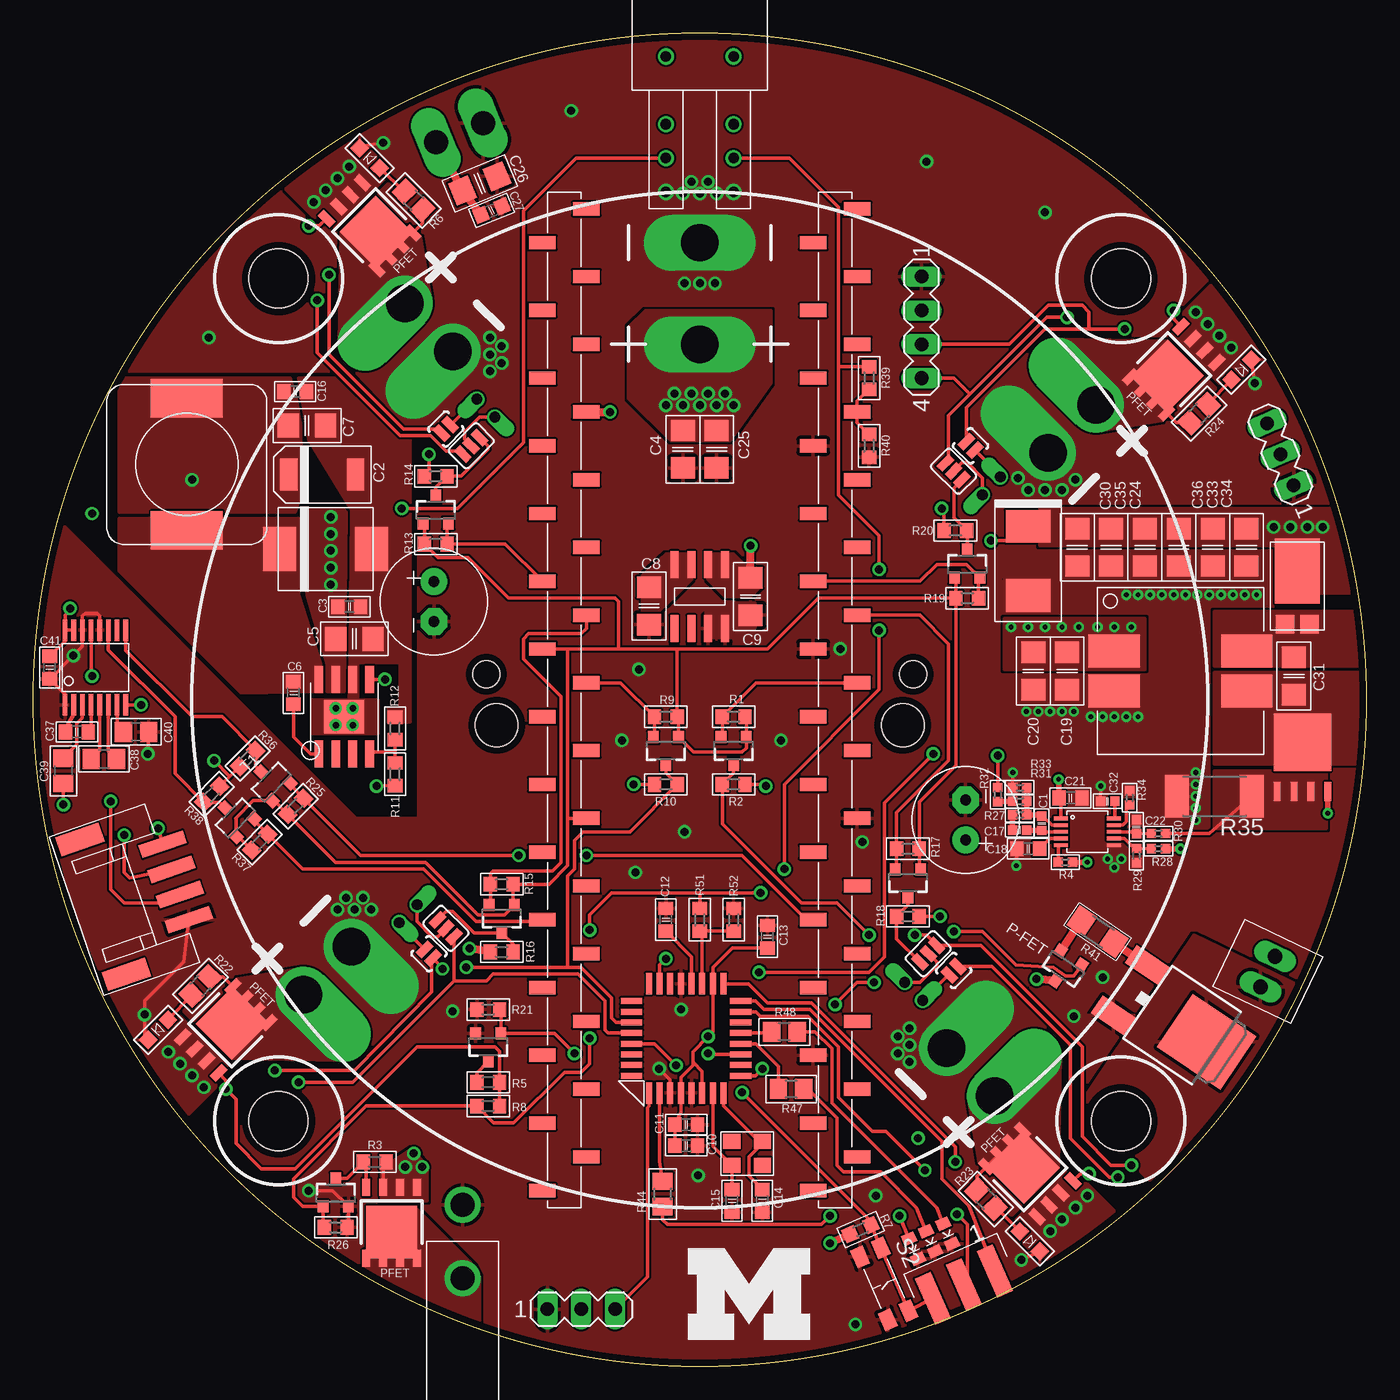
[diagram p8: board, top side]
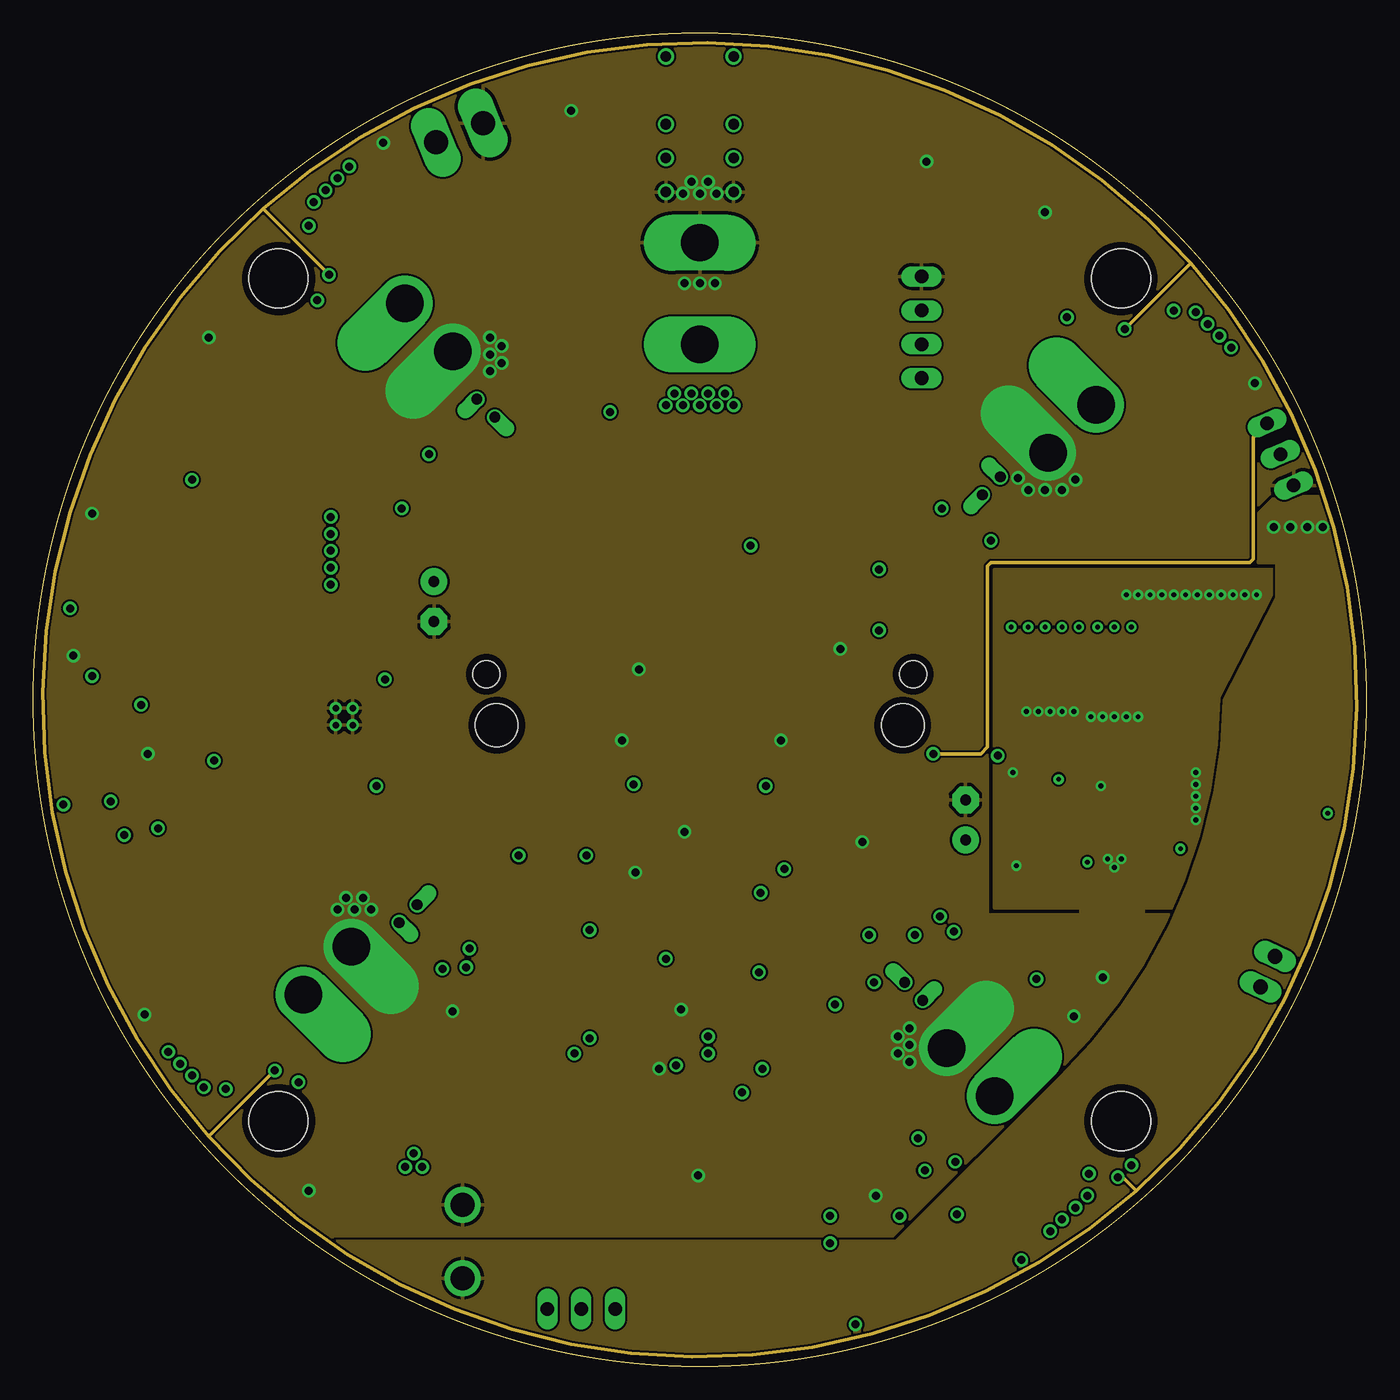
[diagram p9: board, inner layer Route2]
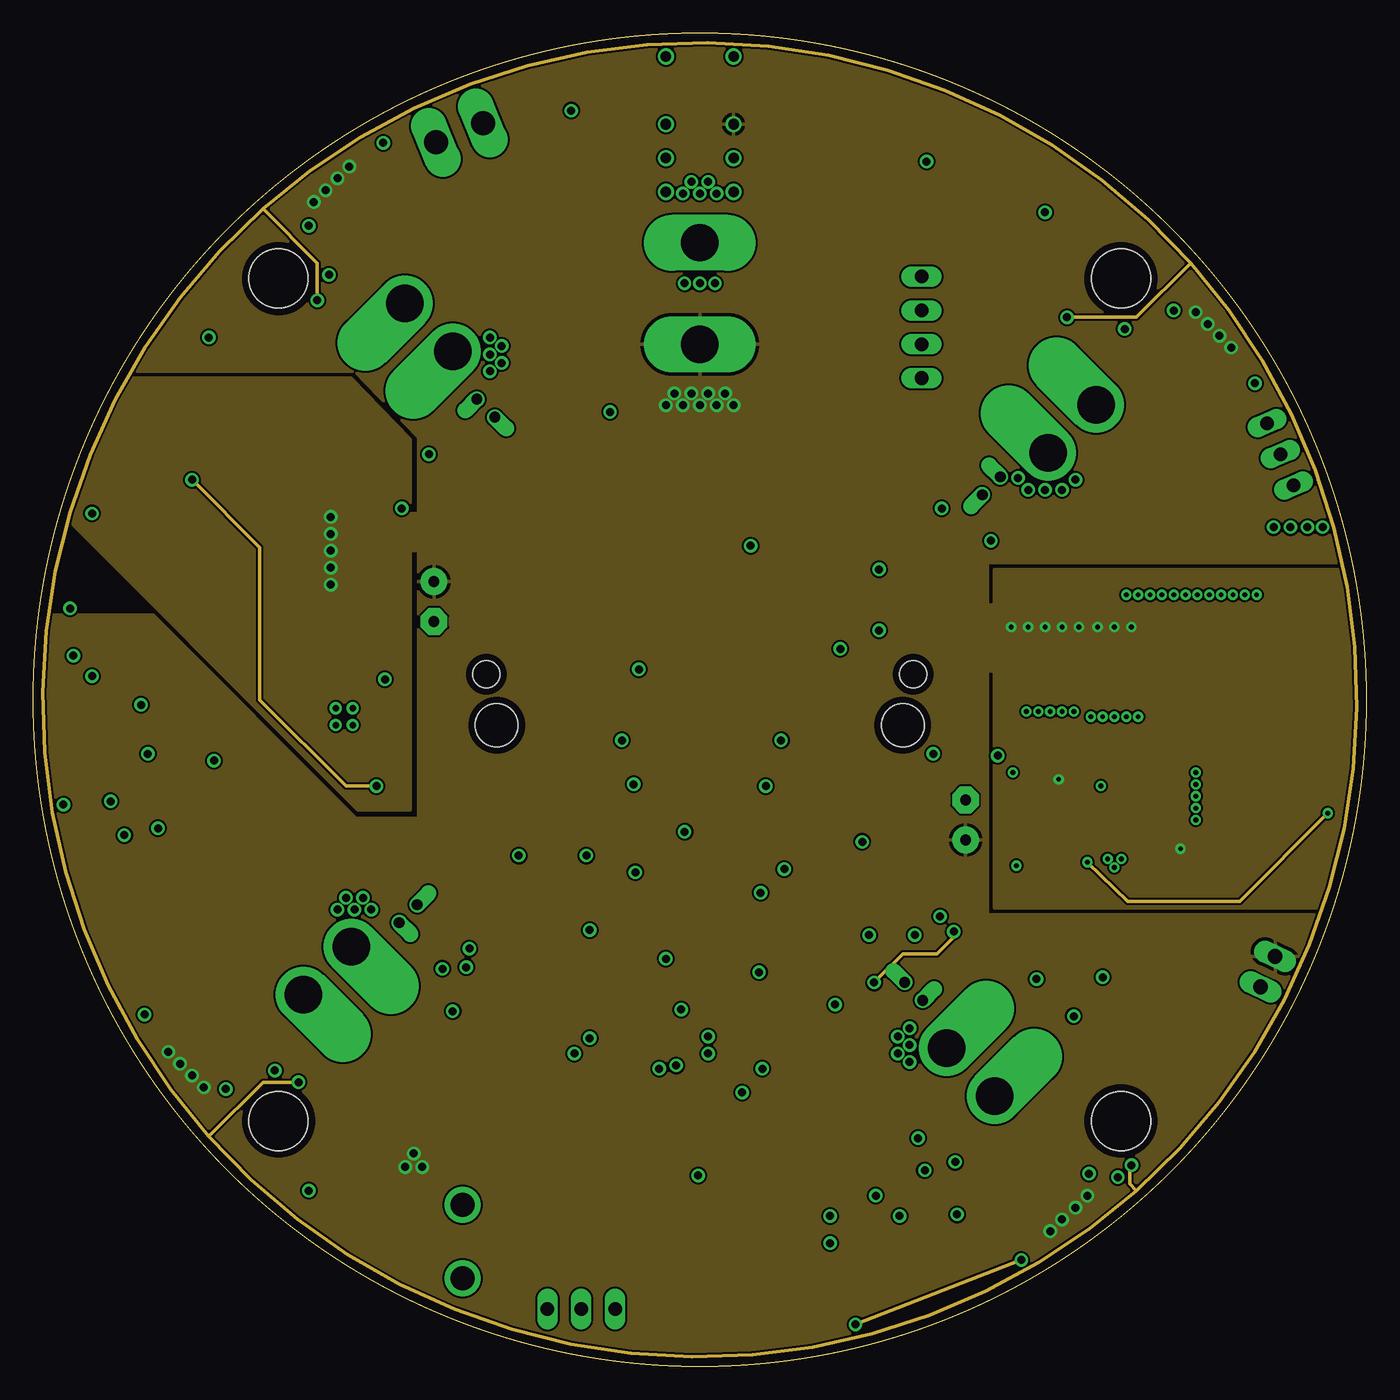
[diagram p10: board, inner layer Route15]
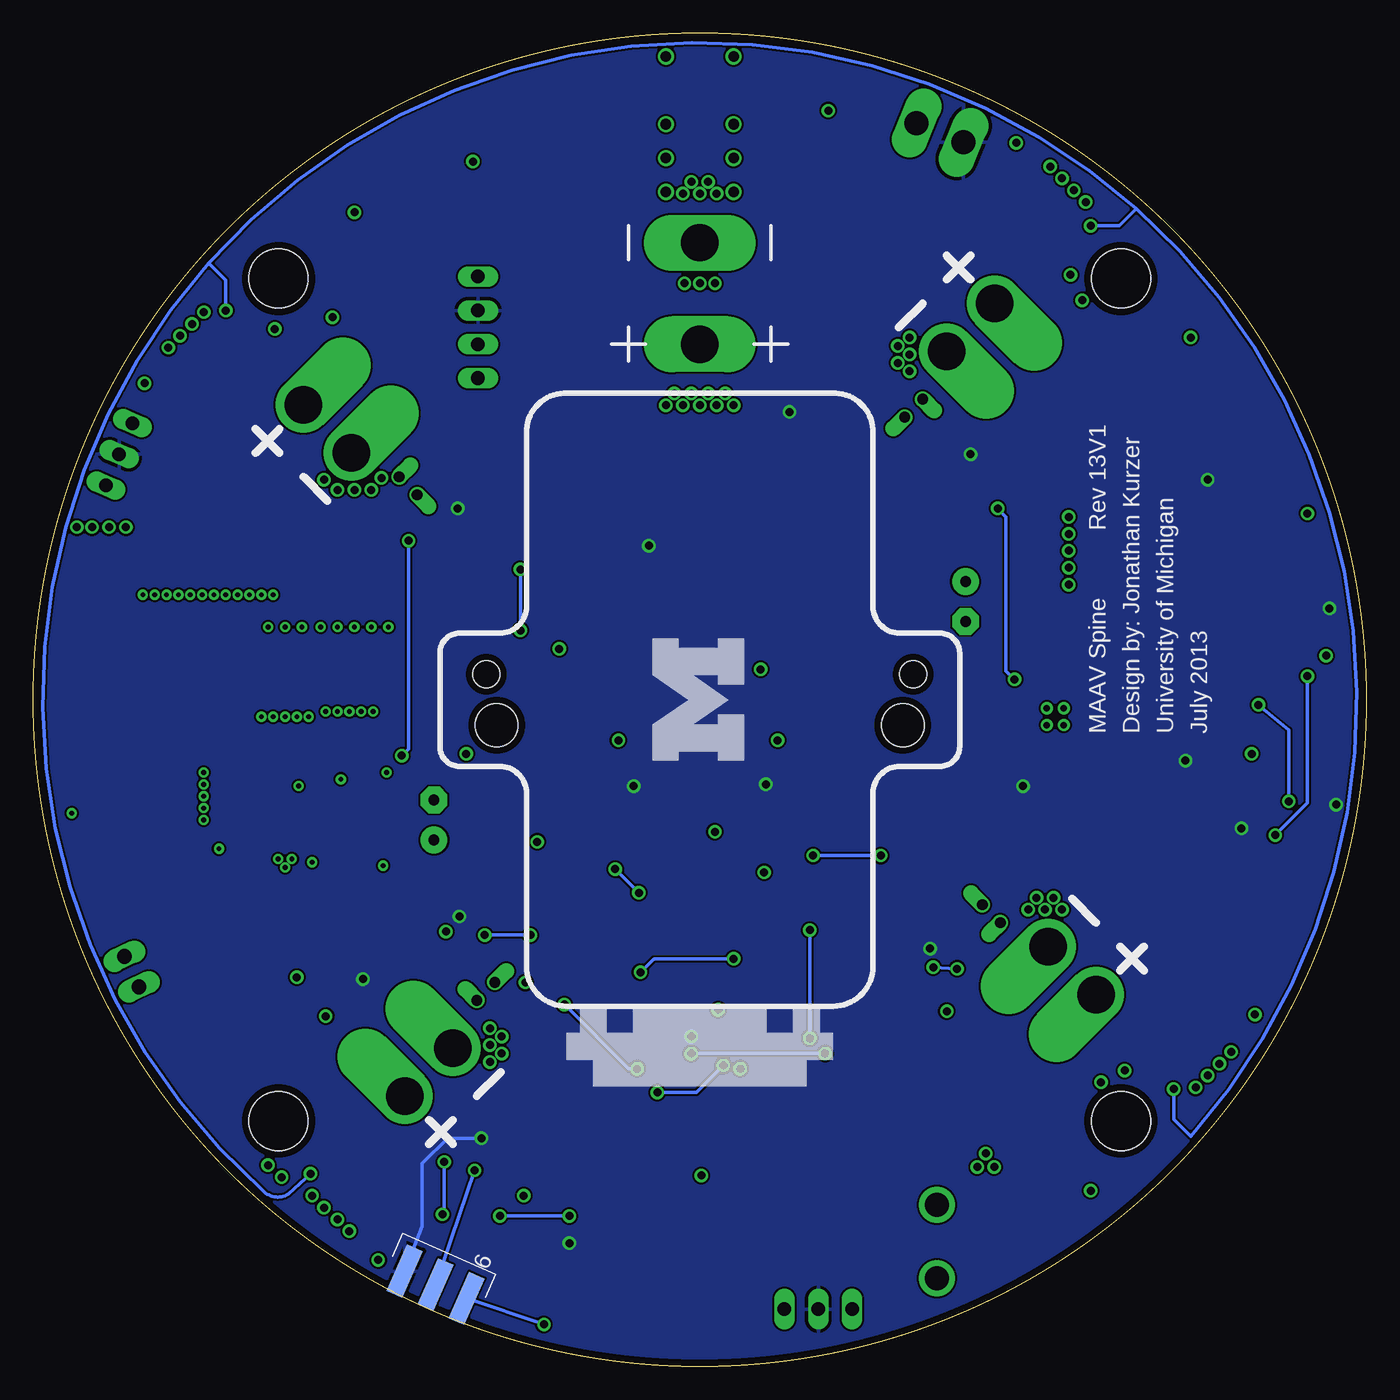
[diagram p11: board, bottom side, seen from below]

Size 100 x 100 mm. Coordinates in mm from the lower left corner, seen from the top.
Outline: circle at 50,50 radius 50
Copper layers (1+2*15+16): Top 0.0178mm / dielectric 12mil / Route2 0.0356mm / dielectric 28mil / Route15 0.0356mm / dielectric 12mil / Bottom 0.0178mm
Design rules: minimum track width 6mil, minimum drill 8mil, track to track 6mil, track to pad 6mil, pad to pad 6mil, via to via 6mil, smd to smd 6mil, copper to edge 20mil, drill to drill 16mil, minimum pad ring 8mil, minimum via ring 8mil, stop-mask expansion 3mil, vias tented up to drill 0mil, thermal gap 10mil
Holes 4.45 mm at 81.6,81.6 81.6,18.4 18.4,18.4 18.4,81.6

### Footprints (pad centres in the part's own frame; a part is rotated, then mirrored left to right if it is on the bottom)
C0402 = smd 0.7 x 0.7: 1 -0.533,0; 2 0.533,0
C_2917_POL = smd 1.3 x 2.4: A -2.5,0; C 2.5,0
C0603 = smd 1 x 1.1: 1 -0.85,0; 2 0.85,0
C1206 = smd 1.6 x 1.8: 1 -1.4,0; 2 1.4,0
C2917 = smd 2.45 x 3.35: + -2.6,0; - 2.6,0
C0805 = smd 1.3 x 1.5: 1 -0.95,0; 2 0.95,0
EH22-9 = drill 0.8 pad 2 octagon: G -1.5,0 | drill 0.8 pad 2: P 1.5,0
PDS760 = smd 1.4 x 1.39: A1 -3.982,0.92; A2 -3.982,-0.92 | smd 4.86 x 3.36: C 0,0
PINTO_SMD = smd 2 x 1: P1 8.509,-36.83; P2 -11.811,-36.83; P3 11.811,-34.29; P4 -8.509,-34.29; P5 8.509,-31.75; P6 -11.811,-31.75; P7 11.811,-29.21; P8 -8.509,-29.21; P9 8.509,-26.67; P10 -11.811,-26.67; P11 11.811,-24.13; P12 -8.509,-24.13; P13 8.509,-21.59; P14 -11.811,-21.59; P15 11.811,-19.05; P16 -8.509,-19.05; P17 8.509,-16.51; P18 -11.811,-16.51; P19 11.811,-13.97; P20 -8.509,-13.97; P21 8.509,-11.43; P22 -11.811,-11.43; P23 11.811,-8.89; P24 -8.509,-8.89; P25 8.509,-6.35; P26 -11.811,-6.35; P27 11.811,-3.81; P28 -8.509,-3.81; P29 8.509,-1.27; P30 -11.811,-1.27; P31 11.811,1.27; P32 -8.509,1.27; P33 8.509,3.81; P34 -11.811,3.81; P35 11.811,6.35; P36 -8.509,6.35; P37 8.509,8.89; P38 -11.811,8.89; P39 11.811,11.43; P40 -8.509,11.43; P41 8.509,13.97; P42 -11.811,13.97; P43 11.811,16.51; P44 -8.509,16.51; P45 8.509,19.05; P46 -11.811,19.05; P47 11.811,21.59; P48 -8.509,21.59; P49 8.509,24.13; P50 -11.811,24.13; P51 11.811,26.67; P52 -8.509,26.67; P53 8.509,29.21; P54 -11.811,29.21; P55 11.811,31.75; P56 -8.509,31.75; P57 8.509,34.29; P58 -11.811,34.29; P59 11.811,36.83; P60 -8.509,36.83
MA-04-SMD = smd 3.5 x 1: 1 2.875,3; 2 2.875,1; 3 2.875,-1; 4 2.875,-3 | smd 3.4 x 1.5: P$1 -2.875,-5.35; P$2 -2.875,5.35
POWER_CONN = drill 1.8: P1 2.75,0; P2 -2.75,0
DRQ125 = smd 3.85 x 2.5: 1 -4.975,1.5; 2 -4.975,-1.5; 3 4.975,-1.5; 4 4.975,1.5
CHIPLED_0603 = smd 0.8 x 1: A -0.825,0; C 0.825,0
CHIPLED_0805 = smd 1 x 1: A 0,-1.05; C 0,1.05
4-SMD_DFN = smd 1.3 x 1.1: GND1 1.15,-0.9; GND2 -1.15,0.9; X1 -1.15,-0.9; X2 1.15,0.9
SOT23-3 = smd 0.8 x 0.9: 1 -0.95,-1; 2 0.95,-1; 3 0,1.1
SO-8_POWER-PAK = smd 0.61 x 1.27: D1 -1.905,2.67; D2 -0.635,2.67; D3 0.635,2.67; D4 1.905,2.67; G 1.905,-2.67; S1 -1.905,-2.67; S2 -0.635,-2.67; S3 0.635,-2.67 | smd 3.81 x 3.91: D5 0,0.69
POWERFLAT-8 = smd 0.495 x 1.4: P$1 -1.905,-1.55; P$2 -0.635,-1.55; P$3 0.635,-1.55; P$4 1.905,-1.55 | smd 4.305 x 4.3: P$5 0,2.152
R0603 = smd 1 x 1.1: 1 -0.85,0; 2 0.85,0
R0402 = smd 0.7 x 0.7: 1 -0.533,0; 2 0.533,0
R0805 = smd 1.3 x 1.5: 1 -0.95,0; 2 0.95,0
R2512 = smd 1.8 x 3.2: 1 -2.8,0; 2 2.8,0
R1206 = smd 1.6 x 1.803: 1 -1.422,0; 2 1.422,0
SWITCH-OFF-MOM = smd 1.45 x 1: P$1 2.575,0.85; P$2 2.575,-0.85; P$3 -2.575,0.85; P$4 -2.575,-0.85
SJ_2S-NO = smd 0.635 x 1.27: 1 -0.45,0; 2 0.45,0
SJ_3 = smd 0.635 x 1.27: 1 -0.889,0; 2 0,0; 3 0.889,0
MA04-1 = drill 1.016 long: 1 -3.81,0; 2 -1.27,0; 3 1.27,0; 4 3.81,0
AVRISP-6-SMD = smd 3.81 x 1.27: GND 0.635,2.54; MOSI 0.635,0; VCC 0.635,-2.54 | smd 3.81 x 1.27 bottom: MISO 0.635,-2.54; RESET 0.635,2.54; SCK 0.635,0
MA03-1 = drill 1.016 long: 1 -2.54,0; 2 0,0; 3 2.54,0
MSOP-10 = smd 0.27 x 1.075: P$1 -1,-1.988; P$2 -0.5,-1.988; P$3 0,-1.988; P$4 0.5,-1.988; P$5 1,-1.988; P$6 1,1.988; P$7 0.5,1.988; P$8 0,1.988; P$9 -0.5,1.988; P$10 -1,1.988
TPS5450 = smd 2.032 x 0.66: P$1 -2.794,1.905; P$2 -2.794,0.635; P$3 -2.794,-0.635; P$4 -2.794,-1.905; P$5 2.794,-1.905; P$6 2.794,-0.635; P$7 2.794,0.635; P$8 2.794,1.905 | smd 2.49 x 2.99: P$9 0,0 | drill 0.5: P$10 0.635,0.635; P$11 0.635,-0.635; P$12 -0.635,-0.635; P$13 -0.635,0.635
32-TQFP = smd 1.6 x 0.45: P$1 -4.1,2.8; P$2 -4.1,2; P$3 -4.1,1.2; P$4 -4.1,0.4; P$5 -4.1,-0.4; P$6 -4.1,-1.2; P$7 -4.1,-2; P$8 -4.1,-2.8; P$17 4.1,-2.8; P$18 4.1,-2; P$19 4.1,-1.2; P$20 4.1,-0.4; P$21 4.1,0.4; P$22 4.1,1.2; P$23 4.1,2; P$24 4.1,2.8 | smd 0.45 x 1.6: P$9 -2.8,-4.1; P$10 -2,-4.1; P$11 -1.2,-4.1; P$12 -0.4,-4.1; P$13 0.4,-4.1; P$14 1.2,-4.1; P$15 2,-4.1; P$16 2.8,-4.1; P$25 2.8,4.1; P$26 2,4.1; P$27 1.2,4.1; P$28 0.4,4.1; P$29 -0.4,4.1; P$30 -1.2,4.1; P$31 -2,4.1; P$32 -2.8,4.1
8-SOIC = smd 2 x 0.6: P$1 -2.4,1.905; P$2 -2.4,0.635; P$3 -2.4,-0.635; P$4 -2.4,-1.905; P$5 2.4,-1.905; P$6 2.4,-0.635; P$7 2.4,0.635; P$8 2.4,1.905
CDRH127 = smd 2.9 x 5.4: P1 -4.95,0; P2 4.95,0
SWITCH_VERT_DPDT = drill 0.8: G1 -2.54,2.54; G2 -2.54,-2.54; P$1 7.62,-2.54; P$2 5.08,-2.54; P$3 2.54,-2.54; P$4 7.62,2.54; P$5 5.08,2.54; P$6 2.54,2.54
ESC_CONN = drill 2.8 offset: BATT 2.54,0; GND -2.54,0 | drill 0.8 offset: SCL/C- -8.255,1.27; SDA/C+ -6.35,1.27
IMU = hole 3.226: -15.24,-1.905; 15.24,-1.905 | hole 2.032: -16.002,1.905; 16.002,1.905
DO-214AB,SMC = smd 2.5 x 3.3: A 3.45,0; C -3.45,0
DPAK = smd 1.6 x 3: 1 -2.28,-5.31; 3 2.28,-5.31 | smd 4.826 x 5.715: TAB 0,1.588
16-TSSOP = smd 0.35 x 1.6: P$1 -2.275,-2.8; P$2 -1.625,-2.8; P$3 -0.975,-2.8; P$4 -0.325,-2.8; P$5 0.325,-2.8; P$6 0.975,-2.8; P$7 1.625,-2.8; P$8 2.275,-2.8; P$9 2.275,2.8; P$10 1.625,2.8; P$11 0.975,2.8; P$12 0.325,2.8; P$13 -0.325,2.8; P$14 -0.975,2.8; P$15 -1.625,2.8; P$16 -2.275,2.8
POWER_HOLES = drill 1.8 long: P$1 -1.905,0; P$2 1.905,0
LIPO_POWER_50A = drill 2.8 long: BATT -3.81,0; GND 3.81,0
SCREW_TERM_2POS = drill 1.1 long: P$1 -1.27,0; P$2 1.27,0

### Placement (x,y rotation side)
C1  75.65,40.73 90 top
C2  21.68,66.89 0 top
C3  23.71,56.98 0 top
C4  48.73,68.8 270 top
C5  24.09,54.57 0 top
C6  19.52,50.51 90 top
C7  20.54,70.57 0 top
C8  46.19,57.04 270 top
C9  53.81,57.75 270 top
C10  48.98,16.55 0 top
C11  48.98,18.12 0 top
C12  47.46,33.49 90 top
C13  55.08,32.22 90 top
C14  54.7,12.41 90 top
C15  52.41,12.41 90 top
C16  19.65,73.11 0 top
C17  74,40.22 180 top
C18  74.64,38.82 180 top
C19  77.56,52.16 270 top
C20  75.02,52.16 270 top
C21  77.81,42.63 0 top
C22  82.77,40.48 90 top
C23  74.64,60.41 270 top
C24  83.4,61.43 270 top
C25  51.27,68.8 270 top
C26  33.49,88.73 202.4 top
C27  34.38,86.7 202.4 top
C30  78.32,61.43 270 top
C31  94.58,51.78 90 top
C32  80.61,42.38 180 top
C33  88.48,61.43 270 top
C34  91.02,61.43 270 top
C35  80.86,61.43 270 top
C36  85.94,61.43 270 top
C37  3.26,47.59 0 top
C38  5.3,45.55 0 top
C39  2.25,44.67 90 top
C40  7.71,47.59 180 top
C41  1.23,52.41 90 top
C42  69.94,40.98 270 top
C43  30.06,57.37 90 top
D1  94.83,59.65 90 top
IC3  50,50 0 top
J7  7.96,35.39 19 top
J9  32.22,9.36 270 top
L2  86.07,52.16 0 top
LED1  66.04,8.81 293.8 top
LED2  67.32,9.38 293.8 top
LED3  68.59,9.94 293.8 top
LED_M0  90.64,74.77 315 top
LED_M1  25.23,90.64 45 top
LED_M2  9.36,25.23 135 top
LED_M3  74.77,9.36 225 top
Q1  53.56,15.96 0 top
Q2  22.7,12.99 0 top
Q3  26.89,10.76 180 top
Q4  85.56,74.77 135 top
Q5  25.23,85.56 225 top
Q6  14.44,25.23 315 top
Q7  74.77,14.44 45 top
Q8  95.21,44.67 0 top
R1  52.54,48.73 0 top
R2  52.54,43.65 0 top
R3  25.62,15.33 0 top
R4  77.43,37.81 0 top
R5  34.12,21.3 0 top
R6  28.54,87.47 315 top
R7  62.06,10.25 203.8 top
R8  34.12,19.52 180 top
R9  47.46,48.73 0 top
R10  47.46,43.65 180 top
R11  27.14,44.41 270 top
R12  27.14,47.84 90 top
R13  30.19,61.68 180 top
R14  30.19,66.76 180 top
R15  35.14,36.16 0 top
R16  35.14,31.08 180 top
R17  65.62,38.82 0 top
R18  65.62,33.74 0 top
R19  70.07,57.62 180 top
R20  69.18,62.7 180 top
R21  34.12,26.76 0 top
R22  12.53,28.54 45 top
R23  71.46,12.53 135 top
R24  87.47,71.46 225 top
R25  19.67,42.01 225 top
R26  22.7,10.41 180 top
R27  74,41.36 0 top
R28  84.42,38.82 0 top
R29  82.77,38.32 90 top
R30  84.42,39.97 0 top
R31  74,42.38 180 top
R32  72.35,42.89 90 top
R33  74,43.4 0 top
R34  82.26,42.63 270 top
R35  88.61,42.76 0 top
R36  16.08,45.6 225 top
R37  16.98,39.31 225 top
R38  13.39,42.91 45 top
R39  62.7,74.13 90 top
R40  62.7,69.05 90 top
R41  79.84,32.6 146 top
R44  47.22,12.92 90 top
R47  56.86,20.79 180 top
R48  56.35,25.09 180 top
R51  50,33.49 90 top
R52  52.54,33.49 270 top
S2  63.84,6.19 293.8 top
SJ1  30.95,70.32 45 top
SJ2  70.32,69.05 315 top
SJ3  69.05,67.14 135 top
SJ4  32.86,69.05 225 top
SJ5  29.68,30.95 135 top
SJ6  30.95,32.86 315 top
SJ7  69.05,29.68 225 top
SJ8  67.14,30.95 45 top
SV1  66.64,77.94 270 top
SV2  69.56,6.69 246.2 bottom
SV3  93.56,68.41 113 top
SV4  41.11,4.28 0 top
T1  17.88,43.8 45 top
T2  15.18,41.11 45 top
T3  52.54,46.19 180 top
T4  47.46,46.19 180 top
T7  30.19,64.22 0 top
T8  35.14,33.62 180 top
T9  65.62,36.28 180 top
T10  70.07,60.16 0 top
T11  34.12,23.96 180 top
U1  79.08,40.09 270 top
U2  23.33,48.73 90 top
U3  48.98,24.6 90 top
U4  50,57.75 90 top
U$1  11.52,67.65 90 top
U$2  50,95.72 270 top
U$3  77.94,70.32 45 top
U$4  29.68,77.94 135 top
U$5  22.06,29.68 225 top
U$6  70.32,22.06 315 top
U$7  [BLOCK-M-10MMW]  53.68,5.3 0 top
U$8  [IMU]  50,50 0 bottom
U$9  21.93,61.3 0 top
U$10  86.7,25.23 236 top
U$11  4.66,52.41 0 top
U$12  31.97,92.55 22.4 top
U$13  50,80.48 90 top
U$14  92.62,29.6 244.4 top
U$15  77.31,29.81 146 top
U$16  [BLOCK-M-10MMW]  50,50 90 bottom

### Tracks (layer width: path | path; a pad name or v marks a point on that pad's centre or on a via)
+1V8
  Top 0.254: R37.2 15.36,39.73 T2.1 15.22,41.08 15.18,41.11 16.5,42.42 T1.1 18.05,42.42 R25.2 22.67,37.81 29.43,37.81 33.36,33.87 35.34,33.87 T8.1 35.99,34.72 R15.2 38.7,36.16 40.09,37.55 40.09,41.11 | T10.1 69.22,59.06 R19.2 | T7.1 29.34,63.12 R13.2 30.35,60.67 32.6,60.67 35.65,57.62 43.65,57.62 43.9,57.37 43.9,53.81 | T9.1 66.47,37.38 R17.2 66.47,42.34 69.22,45.09 R19.2 | R19.2 58.89,57.62 55.08,53.81 48.31,53.81 | 40.09,41.11 40.09,53.81 | 40.09,53.81 IC3.P34 | R1.2 53.49,48.63 T3.1 53.49,46.38 53.17,46.06 49.54,46.06 T4.1 48.41,48.63 R9.2 48.31,53.81 | 48.31,53.81 43.9,53.81 | 43.9,53.81 40.09,53.81 | IC3.P24 40.09,41.11
+3V3
  pour Top (no thermals): 47.46,60.92 49.37,60.92 49.37,59.02 48.09,57.75 46.65,56.38 45.71,56.4 45.71,59.32
+5V  (via drill 0.6)
  Top 0.254: R11.2 v25.74,43.52 | U$11.P$16 2.39,54.42 C41.2 | U$11.P$16 2.38,56.36 v2.76,56.86 | U$11.P$15 U$11.P$16 | C39.1 v2.25,42.13 | R38.2 14.73,44.25 | 14.73,44.25 R36.2 | v13.55,45.43 | v13.55,45.43 14.73,44.25 | J7.1 v9.36,40.35 | R20.2 68.33,64.19 v68.16,64.35 | 49.49,22.82 49.49,23.58 v50.63,24.73 50.98,25.08 U3.P$18 50.98,29.9 52.45,31.37 C13.1 | 49.49,22.82 50.18,22.13 U3.P$6 | 49.49,22.82 49.49,22.57 48.58,21.66 U3.P$4 48.58,19.08 C11.1 C10.1 | v45.05,43.65 R10.2 | v54.95,43.52 54.83,43.65 R2.2 | R18.2 v68.03,33.74 | R14.2 29.68,67.11 v29.68,68.41
  Top 0.61: C9.1 v53.81,61.56 | R7.2 v59.78,9.23 | R16.2 v32.73,31.33 | IC3.P48 v43.27,71.59 | U$12.P$1 C26.2 C27.2 | U$15.3 v75.27,29.05
  Route15 0.254: v25.74,43.52 23.46,43.52 16.98,50 16.98,61.43 v11.9,66.51
  Bottom 0.254: SV2.VCC 70.83,10.5 70.83,15.2 68.92,17.11 v66.38,17.11
  pour Top (no thermals): 54.45,58.38 54.45,59.02 52.54,60.92 50.63,60.92 50.63,59.02 51.91,57.75 53.81,57.75
  pour Top (rank 4, no thermals): 19.27,74.13 6.44,74.13 6.44,64.1 19.65,64.1 20.16,65.75 20.03,71.46
  pour Bottom: 29.68,100.8 71.59,100.8 100.8,71.59 100.8,28.41 71.59,-0.8 28.41,-0.8 -0.8,28.41 -0.8,70.32
+12V  (via drill 0.6)
  Top 0.254: R32.2 v72.35,45.81 | v71.84,61.94 73.56,61.94 C23.+
  Bottom 0.254: v72.35,45.81 71.84,46.32 v71.84,61.94
  other vias: 96.74,62.95 95.59,62.95 94.32,62.95 93.05,62.95
  pour Top (rank 5, no thermals): 75.53,61.56 95.59,61.56 95.59,58 99.4,58 99.4,63.46 98.51,64.35 75.53,64.35
  pour Top (no thermals): 28.66,11.9 33.11,7.45 33.49,6.69 33.49,1.61 24.85,5.42 24.85,8.6
  pour Route2: 103.34,65.24 93.18,65.24 91.91,63.97 91.91,60.29 93.31,60.29 93.31,57.62 89.37,50 arc-45 77.05,21.68 64.73,9.36 20.79,9.36 19.52,8.09 29.68,-2.07 74.13,-2.07 103.34,27.14
BATT_SENSE
  Top 0.254: R52.2 R51.1 50.18,32.46 U3.P$19
BATT_SENSE_GUMSTIX
  Top 0.254: R40.2 61.81,70.79 IC3.P47 61.81,72.39 R39.1
BURN_1  (via drill 0.6)
  Top 0.254: U3.P$9 54.19,21.8 v54.7,22.31 | v60.16,27.14 61.81,28.79 v63.08,28.79 | v69.05,32.6 71.21,32.6 73.7,30.11 76.54,29.93 77.43,29.3 78.07,29.3 U$15.1
  Route15 0.254: v63.08,28.79 65.24,30.95 67.78,30.95 69.05,32.22 v69.05,32.6
  Bottom 0.254: v54.7,22.31 55.33,22.31 v60.16,27.14
COMP
  Top 0.254: U1.P$3 75.76,40.09 C1.1 | 74.56,40.2 C17.1
  Top 0.406: C1.1 74.56,40.2
CS
  Top 0.254: U1.P$8 82.61,40.09 C22.1 R30.1
ENABLE  (via drill 0.6)
  Top 0.254: R26.2 21.75,10.52 Q2.1 20.19,11.99 19.52,12.66 19.52,14.06 24.98,19.52 R8.2 34.55,18.25 36.03,18.25 39.84,22.06 41.11,22.06 41.74,22.7 v41.74,24.6 | U$2.P$5 56.73,90.64 60.41,86.96 60.41,74.89 | 60.41,74.89 60.41,65.37 63.46,62.32 v63.46,59.78 | v63.46,55.21 63.46,50.76 56.35,43.65 v56.35,37.3 | R39.2 60.5,74.98 60.41,74.89 | v54.57,35.52 50,35.52 | 50,35.52 43.4,35.52 41.74,33.87 v41.74,32.73 | R51.2 50,35.52
  Bottom 0.254: v63.46,59.78 v63.46,55.21 | v56.35,37.3 v54.57,35.52 | v41.74,32.73 v41.74,24.6
FB2
  Top 0.254: U1.P$2 76.42,40.59 75.76,41.26 C1.2 75.55,41.36
  Top 0.406: 75.55,41.36 R27.2 R31.1 R33.2
GND  (via drill 0.36, 0.6)
  Top 0.254: C32.2 v80.1,43.52 | R33.1 v73.5,44.54 | C18.2 v73.75,37.55 | R26.1 23.64,10.52 Q2.2 22.46,13.17 v20.66,13.17 | LED_M2.C 8.34,24.77 v8.34,26.38 8.34,27.39 11.28,30.33 J7.4 | LED_M1.C 24.64,91.53 v26.25,91.78 | LED_M0.C v91.66,73.75 | LED_M3.C v74.13,7.96 | U$11.P$1 2.39,50.41 C41.1 1.27,51.56 v3.01,53.3 3.69,53.98 U$11.P$14 3.69,56.26 3.9,56.48 4.79,56.48 4.99,56.28 U$11.P$12 | C40.1 v8.6,45.94 | U3.P$3 47.78,21.48 v46.95,22.31
  Route15 0.254: v74.13,7.96 v61.68,3.14
  Bottom 0.254: SV2.GND v61.68,3.14
  other vias: 80.61,38.06 81.62,38.06 81.11,37.43 91.78,57.87 90.89,57.87 90,57.87 89.12,57.87 88.23,57.87 87.34,57.87 86.45,57.87 85.56,57.87 84.67,57.87 83.78,57.87 82.89,57.87 82,57.87 82.89,48.73 82,48.73 81.11,48.73 80.23,48.73 79.34,48.73 78.07,49.11 77.18,49.11 76.29,49.11 75.4,49.11 74.51,49.11 87.21,42.76 87.21,43.65 87.21,41.87 87.21,44.54 87.21,40.98 49.87,14.31 48.6,26.76 31.46,26.63 62.19,39.33 60.54,53.81 63.21,12.79 80.23,29.17 78.07,26.25 51.27,87.97 50.63,88.86 50,87.97 48.73,87.97 49.37,88.86 50,81.24 48.86,81.24 51.14,81.24 35.14,76.54 34.25,75.91 34.25,77.18 35.14,75.27 34.25,74.64 78.19,66.51 75.91,65.75 77.18,65.75 73.88,66.64 74.64,65.75 64.86,23.46 65.75,24.09 65.75,22.82 64.86,24.73 65.75,25.36 23.46,35.14 24.09,34.25 22.82,34.25 24.73,35.14 25.36,34.25 45.43,52.29 44.16,46.95 48.86,40.09 45.17,37.05 56.1,46.95 13.17,77.18 4.41,63.97 67.02,90.39 75.91,86.58 40.35,94.2
  pour Top (no thermals): 54.14,57.26 50.94,57.26 50.48,56.81 50.48,55.13 50.94,54.67 53.38,54.67 54.14,55.44
  pour Top (rank 2, no thermals): 20.92,47.46 25.87,47.46 25.87,50 24.35,50 24.35,52.79 27.52,52.79 27.52,49.37 26.63,49.37 26.63,48.35 28.28,48.35 28.28,69.56 23.84,74.13 19.9,74.13 20.66,69.56 23.84,64.35 23.71,50 20.92,50
  pour Top (rank 3, no thermals): 72.86,61.05 72.73,36.92 94.96,36.79 94.96,61.05
  pour Route2 (rank 4): 29.68,100.8 -0.8,70.32 -0.8,28.41 29.68,-0.8 71.59,-0.8 100.8,28.41 100.8,33.87 83.27,33.87 83.27,34.38 100.8,34.38 100.8,59.78 72.1,59.78 72.1,34.38 78.58,34.38 78.58,33.87 71.59,33.87 71.59,60.29 100.8,60.29 100.8,71.59 71.59,100.8
  pour Top (rank 6): 29.68,100.8 71.59,100.8 100.8,71.59 100.8,28.41 71.59,-0.8 28.41,-0.8 -0.8,28.41 -0.8,66.13 24.22,41.11 28.92,41.11 28.92,69.69 24.09,74.64 3.52,74.64
  pour Top (no thermals): 44.67,83.02 45.94,81.75 53.81,81.75 54.06,81.75 55.33,83.02 55.33,87.85 53.81,89.37 46.19,89.37 44.92,88.1 44.67,87.85
KILL_SIG  (via drill 0.6)
  Top 0.254: U3.P$23 46.98,30.09 v47.46,30.57 | v54.45,29.55 62.7,29.55 63.84,30.7 63.84,42.25 v67.53,45.94
  Route2 0.254: v67.53,45.94 71.08,45.94 71.59,46.44 71.59,60.03 71.84,60.29 91.28,60.29 91.53,60.54 91.53,69.71 SV3.3
  Bottom 0.254: v47.46,30.57 53.43,30.57 v54.45,29.55
LED1
  Top 0.254: U3.P$13 55.06,25 R48.2
LED2
  Top 0.254: U3.P$12 54.21,24.2 55.91,22.5 R47.2
LED3
  Top 0.254: U3.P$2 46.98,15.38 R44.2
MISO
  Top 0.254: U3.P$16 54.19,27.4 54.83,26.76 58.26,26.76 68.16,16.85 68.16,14.06 70.19,12.03 SV2.MISO
MOSI  (via drill 0.6)
  Top 0.254: U3.P$15 54.22,26.6 54.57,26.25 58.13,26.25 60.41,23.96 60.41,20.16 62.95,17.62 63.97,17.62 v66.89,14.69
  Bottom 0.254: v66.89,14.69 SV2.MOSI
MOTOR0_PWM_1V8
  Top 0.254: R19.1 70.92,59.06 T10.2 70.02,60.16 67.78,60.16 66.51,58.89 IC3.P37
MOTOR1_PWM_1V8
  Top 0.254: T7.2 31.04,63.12 R13.1 35.39,61.68 IC3.P38
MOTOR2_PWM_1V8
  Top 0.254: T8.2 34.29,34.72 R15.1 34.29,36.96 34.51,37.17 38.95,37.17 39.59,37.81 39.59,50.25 36.79,53.05 36.79,54.57 37.17,54.95 41.11,54.95 41.49,55.33 IC3.P36
MOTOR3_PWM_1V8
  Top 0.254: T9.2 64.77,37.38 R17.1 64.77,41.53 68.67,45.43 68.67,54.19 66.51,56.35 IC3.P35
MOTOR_ENABLE  (via drill 0.6)
  Top 0.254: Q5.G 21.46,85.56 v20.66,85.56 | Q4.G 85.56,78.54 v85.56,79.21 | Q6.G 14.44,21.46 v14.44,20.79 15.2,20.03 15.2,16.73 17.11,14.82 19.65,14.82 28.79,23.96 34.63,23.96 34.98,23.62 R5.2 R8.1 | Q7.G 78.54,14.44 v79.21,14.44
  Bottom 0.254: v20.66,85.56 18.5,85.56 17.23,86.83 | 17.23,86.83 arc90 13.17,17.23 14.44,18.5 v14.44,20.79 | 86.83,82.77 arc-90 82.77,13.17 arc-80 80.86,12.92 v79.21,14.44 | 86.83,82.77 arc90 17.23,86.83 | v85.56,79.21 85.56,81.5 86.83,82.77
MOTOR_LOGIC  (via drill 0.6)
  Top 0.254: R21.2 35.08,26.66 T11.1 39.09,24.96 v40.6,23.46 | v50.63,23.46 50.69,23.4 U3.P$11
  Bottom 0.254: v40.6,23.46 v50.63,23.46
N$1
  Top 0.254: U$11.P$2 3.04,48.88 2.41,47.88 C37.1
N$2  (via drill 0.6)
  Top 0.254: R44.1 47.22,10.99 47.59,10.63 59.14,10.63 v59.78,11.27 | v64.99,11.27 LED1.A
  Bottom 0.254: v59.78,11.27 v64.99,11.27
N$3
  Top 0.254: C12.1 49.38,30.72 U3.P$20
N$4
  Top 0.254: R11.1 27.14,46.06 | 27.14,46.06 R12.1 | U2.P$4 25.36,46.06 27.14,46.06
N$5
  Top 0.254: R24.2 85.76,70.79 Q4.D1
  pour Top (no thermals): 84.67,70.95 80.1,70.19 76.67,77.05 85.05,76.92
N$6
  Top 0.254: C14.2 53.68,14.27 53.68,15.71 54.71,16.73 Q1.X2 | 54.32,17.25 Q1.X2 | U3.P$8 51.78,19.51 54.43,16.86 Q1.X2
N$7
  Top 0.254: T11.3 33.27,22.02 R5.1
N$8
  Top 0.254: Q1.X1 C15.2 | 52.41,15.2 Q1.X1 | U3.P$7 50.98,16.49 Q1.X1
N$9
  Top 0.254: U2.P$1 20.79,45.94 19.52,47.21 C6.1
N$10
  Top 0.254: SJ2.2 72.55,66.82 U$3.SDA/C+
N$11  (via drill 0.6)
  Top 0.254: U2.P$5 v26.38,51.52 | v27.65,64.35 31.84,64.35 36.79,69.3 36.79,86.7 40.73,90.64 U$2.P$2
  Bottom 0.254: v27.65,64.35 27.01,63.72 27.01,52.16 v26.38,51.52
N$12
  Top 0.254: SJ3.2 69.69,67.78 70.07,67.78 71.2,66.64 U$3.SCL/C-
N$13
  Top 0.254: LED_M0.A R24.1
N$14
  Top 0.254: R6.2 29.21,85.76 Q5.D1
  pour Top (no thermals): 29.05,84.67 29.81,80.1 22.95,76.67 23.08,85.05
N$15
  Top 0.254: LED_M1.A R6.1
N$16
  Top 0.254: SJ1.2 31.36,70.64 U$4.SDA/C+
N$17
  Top 0.254: SJ4.2 32.35,69.56 32.35,70.07 33.49,71.2 U$4.SCL/C-
N$18
  Top 0.254: R22.2 14.24,29.21 Q6.D1
  pour Top (no thermals): 15.33,29.05 19.9,29.81 23.33,22.95 14.95,23.08
N$19
  Top 0.254: LED_M2.A R22.1
N$20
  Top 0.254: SJ5.2 27.45,33.18 U$5.SDA/C+
N$21
  Top 0.254: SJ6.2 30.32,32.22 29.93,32.22 28.8,33.36 U$5.SCL/C-
N$22
  Top 0.254: R23.2 70.79,14.24 Q7.D2
  pour Top (no thermals): 70.95,15.33 70.19,19.9 77.05,23.33 76.92,14.95
N$23
  Top 0.254: R23.1 72.26,11.86 LED_M3.A
N$24
  Top 0.406: R27.1 C17.2
N$25
  Top 0.254: SJ7.2 68.64,29.36 U$6.SDA/C+
N$26
  Top 0.254: SJ8.2 67.78,30.32 67.78,30.06 66.51,28.8 U$6.SCL/C-
N$27
  Top 0.254: Q3.G 24.98,15.11 R3.1 23.53,14.09 Q2.3
N$28
  pour Top (rank 3, no thermals): 21.55,50.63 21.55,52.67 19.9,57.87 19.9,63.59 6.44,63.59 6.44,59.65 15.58,50.51
N$29  (via drill 0.36)
  Top 0.406: R4.2 v79.08,37.81 | v97.12,41.49 Q8.P$4
  Route15 0.254: v79.08,37.81 82.13,34.89 90.51,34.89 v97.12,41.49
N$30
  pour Top (rank 2, no thermals): 88.61,52.54 88.61,56.6 99.53,56.6 99.53,52.54
N$31
  Top 0.254: 72.35,42.38 R32.1
  Top 0.406: R31.2 72.35,42.38
N$32
  Top 0.254: U$11.P$4 4.34,47.81 C37.2
N$33
  Top 0.254: R47.1 58.13,20.79 60.29,18.63 60.29,15.08 60.8,14.57 63.59,14.57 66.26,11.9 LED2.A
N$34
  Top 0.254: R48.1 58.65,25.09 59.91,23.84 59.91,19.77 67.78,11.9 LED3.A
N$35
  Top 0.254: U$11.P$5 4.99,46.2 C38.1
N$36
  Top 0.254: U$11.P$6 5.64,46.16 C38.2
N$37
  Top 0.254: U$11.P$3 3.69,48.64 3.26,48.22 3.26,46.63 C39.2
N$38
  Top 0.254: U$11.P$7 6.29,48.06 C40.2
N$40
  pour Top: 87.08,32.35 101.31,25.49 89.37,8.73 78.19,19.14
N$42
  Top 0.61: R41.2 78.54,33.39 U$15.2
N$43
  Top 0.61: R41.1 U$10.1
OUT
  Top 0.254: U1.P$5 76.9,39.09 R4.1
PWM_5V_M0
  Top 0.254: SJ3.1 69.05,65.89 69.05,63.68 R20.1 70.07,61.85 T10.3
PWM_5V_M1
  Top 0.254: T7.3 30.19,65.91 R14.1 32.09,66.76 34.12,68.8 34.12,69.04 SJ4.1
PWM_5V_M2
  Top 0.254: R16.1 35.99,31.67 T8.3 33.07,32.52 31.46,34.12 30.96,34.12 SJ6.1
PWM_5V_M3
  Top 0.254: SJ8.1 64.77,32.07 R18.1 65.62,34.59 T9.3
Q3_D
  pour Top (rank 2, no thermals): 88.61,52.03 99.53,52.03 99.53,45.17 88.61,45.17
Q3_S
  Top 0.254: R30.2 88.23,39.97 R35.2
  pour Top (rank 2, no thermals): 88.61,44.67 96.99,44.67 96.99,40.35 88.61,40.35
RESET  (via drill 0.6)
  Top 0.254: SV2.RESET S2.P$1 S2.P$3 R7.1 62.84,10.87 v53.17,20.54 | U3.P$29 46.59,24.2 v48.22,22.57
  Bottom 0.254: v48.22,22.57 50.25,20.54 v53.17,20.54
RS-232_RX1  (via drill 0.6)
  Top 0.254: J7.3 10.38,34.76 6.82,34.76 5.8,35.78 v5.8,42.38 | v8.09,49.62 v8.08,49.61 U$11.P$8
  Bottom 0.254: v5.8,42.38 5.8,47.71 v8.09,49.62
RS-232_TX1  (via drill 0.6)
  Top 0.254: J7.2 7.22,36.64 6.82,37.05 v6.82,39.84 | v4.41,51.78 4.34,51.85 U$11.P$13
  Bottom 0.254: v6.82,39.84 4.41,42.25 v4.41,51.78
RT
  Top 0.254: U1.P$9 81.74,40.59 82,40.86 82,41.85 R34.2
RX1_1V8  (via drill 0.6)
  Top 0.254: T1.2 19.26,43.63 R25.1 24.57,38.32 v36.41,38.32 | IC3.P17 58,33.49 53.17,38.32 v41.49,38.32
  Bottom 0.254: v41.49,38.32 v36.41,38.32
RX1_5V
  Top 0.254: T1.3 16.68,45 R36.1 14.15,48.73 11.9,48.73 6.94,53.69 U$11.P$9
SCK  (via drill 0.6)
  Top 0.254: U3.P$17 53.65,28.7 55.08,27.27 58.38,27.27 69.18,16.47 v69.18,15.33 | v69.3,11.39 70.07,10.63 70.07,6.36 SV2.SCK
  Bottom 0.254: v69.18,15.33 69.18,11.52 v69.3,11.39
SCL_1V8
  Top 0.254: T3.2 51.69,47.29 R1.1 54.23,51.27 IC3.P31
SCL_5V  (via drill 0.6)
  Top 0.254: SJ3.3 68.67,68.02 68.67,71.34 70.26,72.92 | SJ4.3 31.98,68.67 30.95,68.67 29.81,69.81 27.52,69.81 21.3,76.03 v21.3,79.97 | 70.26,72.92 76.03,78.7 v77.56,78.7 | SJ6.3 31.58,28.91 | 31.58,28.91 23.96,21.3 v19.9,21.3 | T3.3 52.54,44.5 R2.1 51.69,40.69 57.62,34.76 60.29,34.76 v62.7,32.35 | v66.13,32.35 67,32.35 SJ8.3 71.09,31.58 78.7,23.96 78.7,17.23 80.86,15.08 v82.38,15.08 | U3.P$28 43.12,25 42.89,25.23 42.89,27.39 40.86,29.43 34.51,29.43 33.99,28.91 31.58,28.91 | SV1.4 69.05,74.13 70.26,72.92
  Route15 0.254: 82.77,13.17 arc90 86.83,82.77 | 86.83,82.77 arc90 17.23,86.83 | 17.23,86.83 arc90 13.17,17.23 | 13.17,17.23 arc90 82.77,13.17 | v21.3,79.97 21.3,82.77 17.23,86.83 | v77.56,78.7 82.77,78.7 86.83,82.77 | v19.9,21.3 17.23,21.3 13.17,17.23 | v82.38,15.08 82.26,14.69 82.26,13.68 82.77,13.17
  Bottom 0.254: v66.13,32.35 v62.7,32.35
SDA_1V8
  Top 0.254: T4.2 46.61,47.29 R9.1 44.07,51.27 IC3.P32
SDA_5V  (via drill 0.6)
  Top 0.254: SJ1.1 30.31,70.32 27.77,70.32 22.19,75.91 v22.19,81.88 | SJ2.1 70,71.91 75.91,77.81 79.21,77.81 | 79.21,77.81 v81.88,77.81 | SJ7.1 71.91,30 77.81,24.09 77.81,17.11 80.73,14.19 v81.37,14.19 | v18.12,22.19 24.09,22.19 29.87,28.09 29.87,30.5 SJ5.1 | T4.3 47.46,44.5 R10.1 44.75,40.09 41.24,40.09 40.6,39.46 40.6,37.3 40.09,36.79 40.09,29.93 | SJ5.1 | SJ5.1 v30.7,29.81 | v32.47,29.93 40.09,29.93 | 40.09,29.93 41.11,29.93 43.4,27.65 43.4,26.12 43.72,25.8 U3.P$27 | SV1.3 73.24,76.67 76.16,79.59 78.7,79.59 79.21,79.08 79.21,77.81
  Route2 0.254: 82.77,13.17 arc90 86.83,82.77 | 86.83,82.77 arc90 17.23,86.83 | 17.23,86.83 arc90 13.17,17.23 | 13.17,17.23 arc90 82.77,13.17 | v22.19,81.88 17.23,86.83 | v81.88,77.81 86.83,82.77 | v18.12,22.19 13.17,17.23 | v81.37,14.19 81.75,14.19 82.77,13.17
  Bottom 0.254: v30.7,29.81 v32.47,29.93
SERVO_1
  Top 0.254: U3.P$1 46.18,19.51 46.06,19.39 46.06,6.69 SV4.3
SS2
  Top 0.254: U1.P$10 81.14,41.09 C32.1
TX1_1V8
  Top 0.254: T2.2 16.56,40.93 R37.1 20.2,37.3 29.3,37.3 33.24,33.36 38.06,33.36 IC3.P18
TX1_5V
  Top 0.254: T2.3 13.99,42.3 R38.1 10.63,44.46 10.63,48.73 5.64,53.72 U$11.P$11
UVLO
  Top 0.254: U1.P$7 81.87,39.59 82.61,38.85 R29.2 R28.1
V_BATT  (via drill 0.36, 0.6)
  Top 0.254: U1.P$1 77.1,42.63 C21.1 | R3.2 26.25,15.11 Q3.S3
  Top 0.406: C21.1 v76.92,44.03 | R28.2 v86.07,38.82
  other vias: 22.31,63.72 22.31,62.45 22.31,61.18 22.31,59.91 22.31,58.64 81.11,55.46 78.45,55.46 82.38,55.46 79.84,55.46 77.18,55.46 75.91,55.46 74.64,55.46 73.37,55.46 88.1,78.19 88.99,77.31 89.88,76.42 29.17,14.95 28.54,15.96 27.9,14.95 10.12,23.58 11.01,22.7 11.9,21.81 12.79,20.92 87.21,79.08 76.29,10.12 77.18,11.01 78.19,11.9 79.08,12.79 23.71,90 22.82,89.12 21.93,88.23 21.04,87.34 50,72.1 48.09,72.99 50.63,72.99 48.73,72.1 49.37,72.99 51.27,72.1 51.91,72.99 52.54,72.1 47.46,72.1
  pour Top (no thermals): 73.11,10.38 77.43,6.06 81.88,10.88 78.19,14.57 77.31,14.57
  pour Top (no thermals): 89.62,73.11 93.94,77.43 89.12,81.88 85.43,78.19 85.43,77.31
  pour Top (no thermals): 26.89,89.62 22.57,93.94 18.12,89.12 21.81,85.43 22.7,85.43
  pour Top (no thermals): 10.38,26.89 6.06,22.57 10.88,18.12 14.57,21.81 14.57,22.7
  pour Top (no thermals): 23.33,50.63 23.46,64.1 23.2,64.35 20.66,64.35 20.41,64.1 20.54,57.87 22.06,52.67 22.06,50.63
  pour Top (rank 2, no thermals): 83.4,52.29 72.86,52.29 72.86,56.1 83.4,56.1
  pour Route15 (rank 5): 3.52,74.64 29.68,100.8 71.59,100.8 100.8,71.59 100.8,60.29 71.59,60.29 71.59,57.11 72.1,57.11 72.1,59.78 100.8,59.78 100.8,34.38 72.1,34.38 72.1,52.16 71.59,52.16 71.59,33.87 100.8,33.87 100.8,28.41 71.59,-0.8 29.68,-0.8 -0.8,28.41 -0.8,56.35 8.98,56.35 24.22,41.11 28.92,41.11 28.92,69.69 24.09,74.64
  pour Top (no thermals): 26.12,12.41 29.55,12.41 29.55,14.95 28.41,16.34 26.12,14.82
  pour Route15: 23.84,74.13 28.28,69.56 28.28,63.97 29.68,63.97 29.68,61.18 28.28,61.18 28.28,41.74 24.35,41.74 -0.8,66.89 -0.8,74.13
  pour Top (no thermals): 45.94,79.21 55.33,79.21 55.33,73.75 52.29,69.43 47.84,69.43 44.67,72.61 44.67,77.94
VCC2
  Top 0.254: U1.P$4 76.26,39.59 C18.1

### Text on the board
tPlace: PFET | PFET | P-FET | PFET | PFET | PFET
bPlace: Rev 13V1 | July 2013 | University of Michigan | Design by: Jonathan Kurzer | MAAV Spine
Reference: Front of Vehicle | Battery | ATOM Power | Serial | Burn Wire | USB